# Altium schematic sheet 0153_HPB BATTERY CHARGE.SchDoc
size 848 x 558 mm
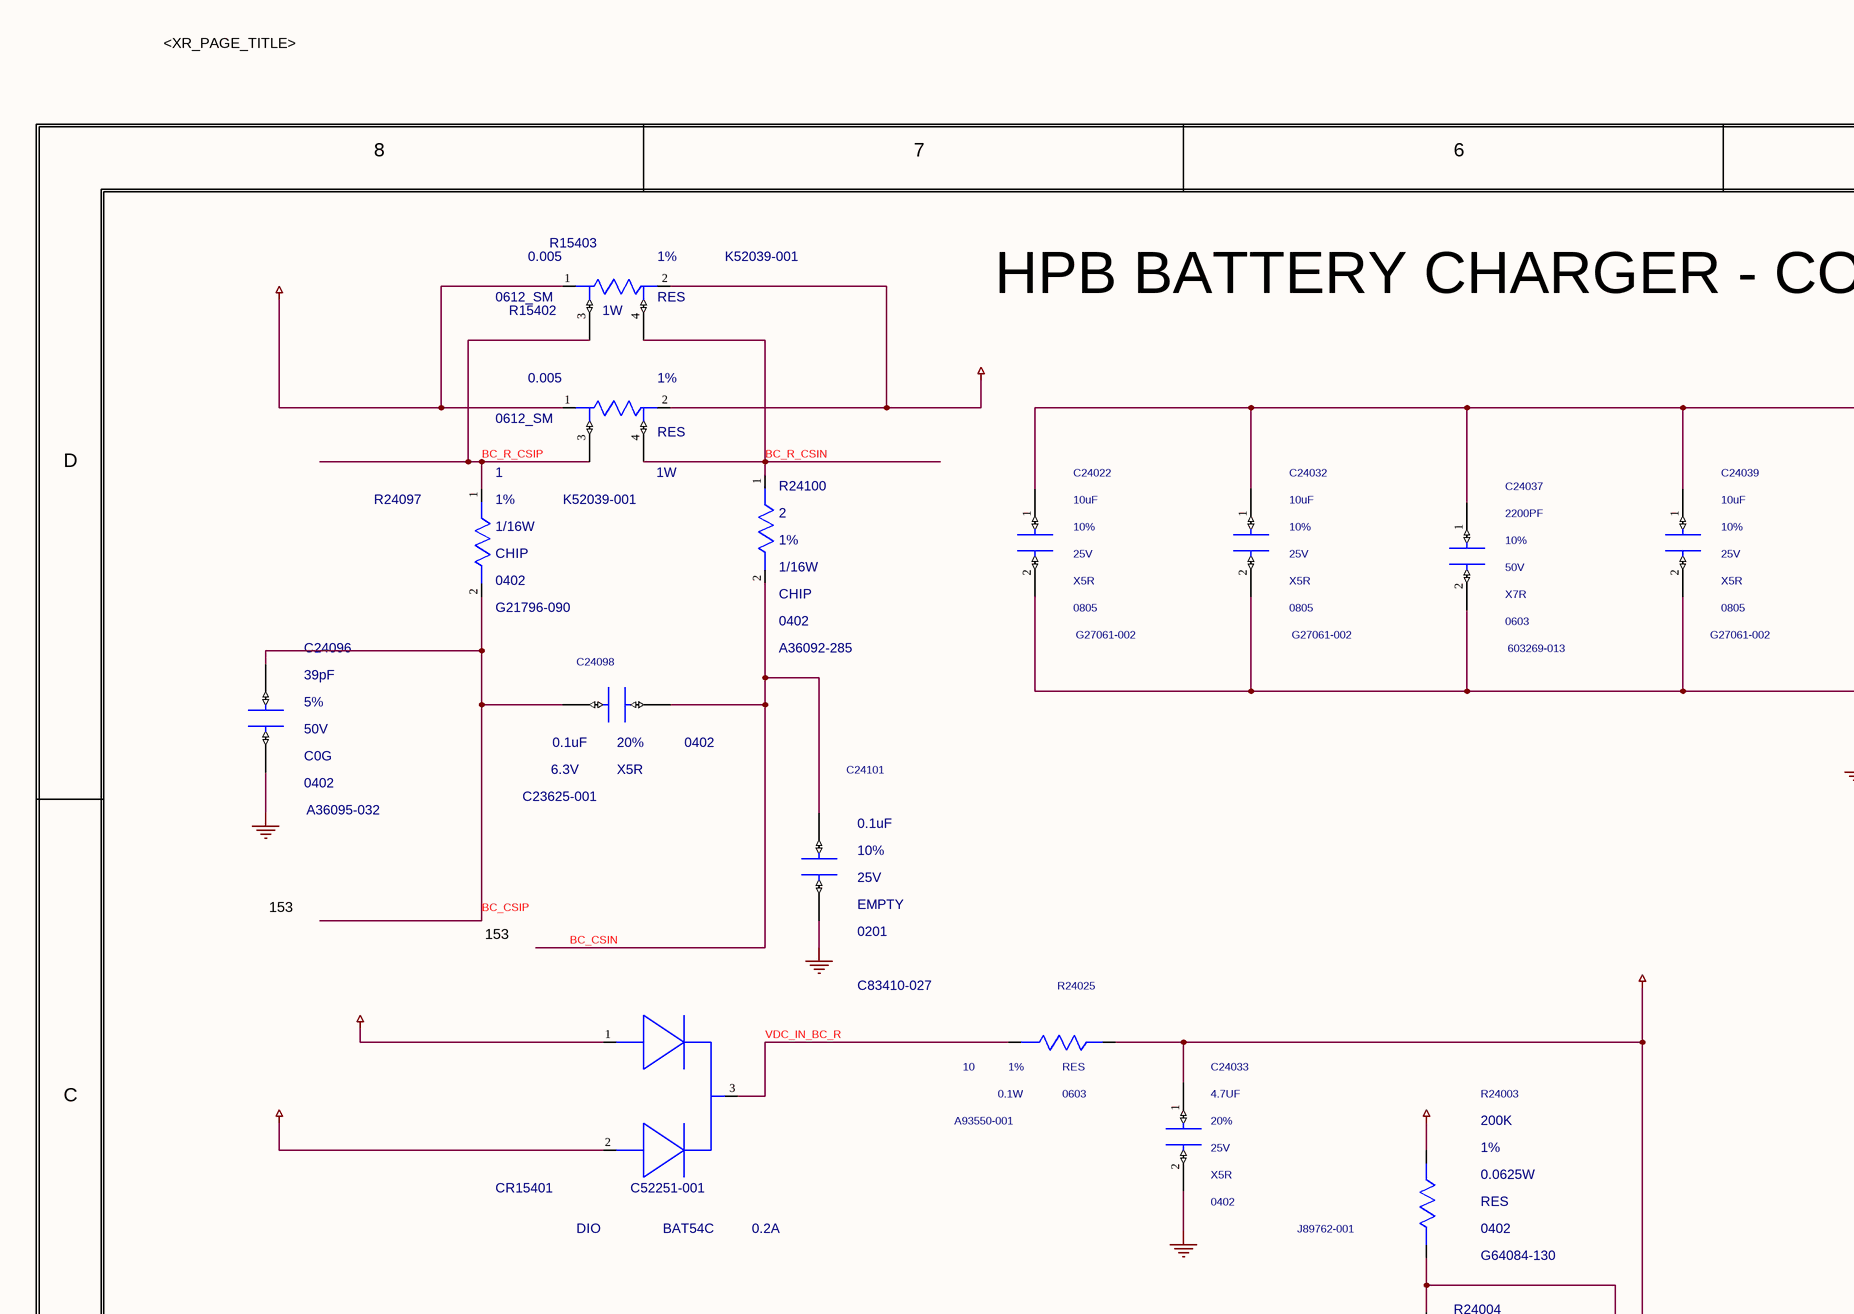
[diagram p0: 0153_HPB BATTERY CHARGE.SchDoc, top left]
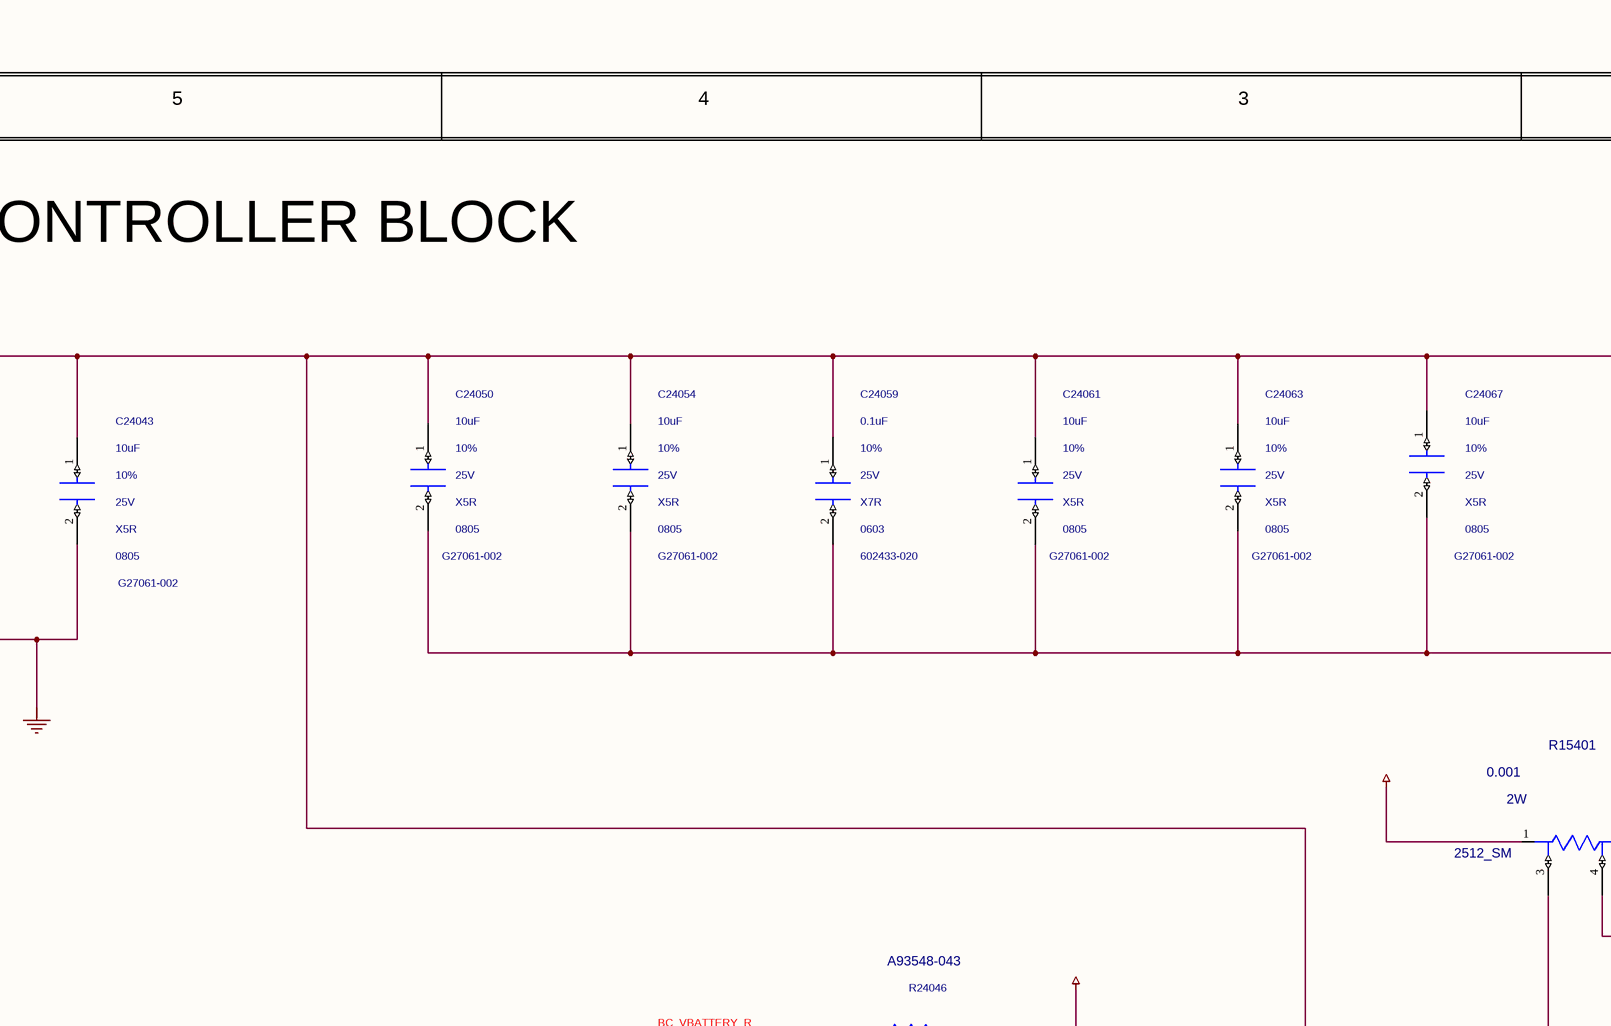
[diagram p1: 0153_HPB BATTERY CHARGE.SchDoc, top middle]
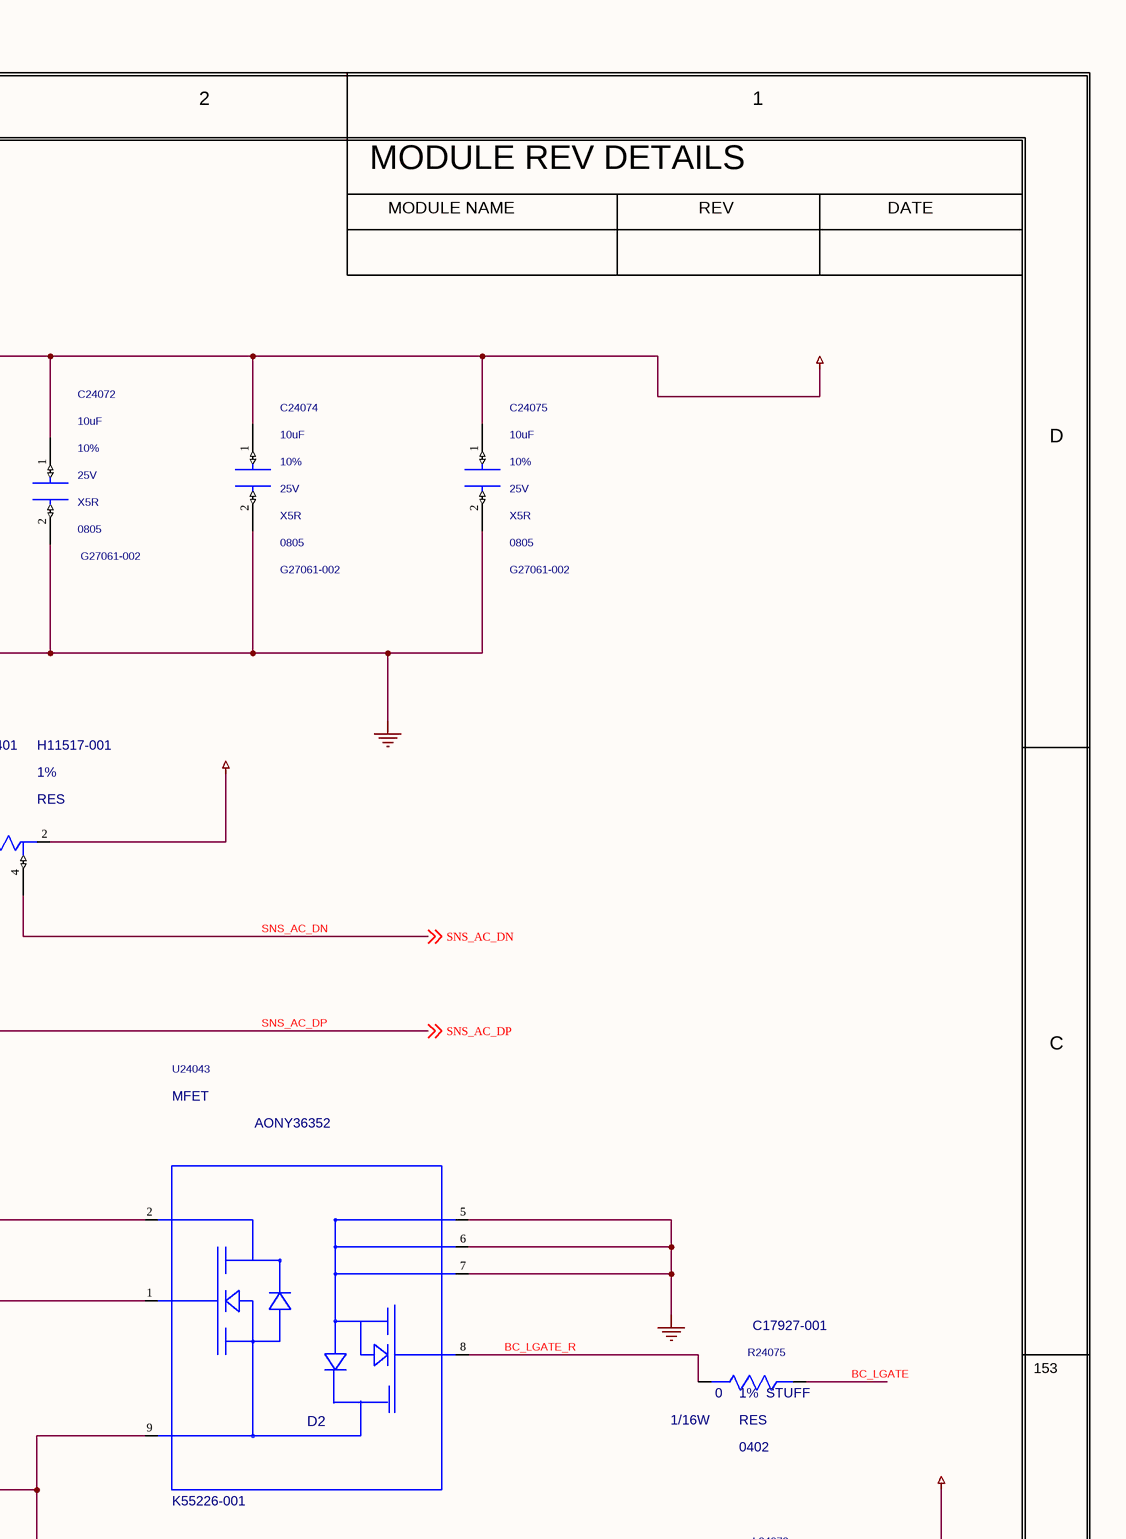
[diagram p2: 0153_HPB BATTERY CHARGE.SchDoc, top right]
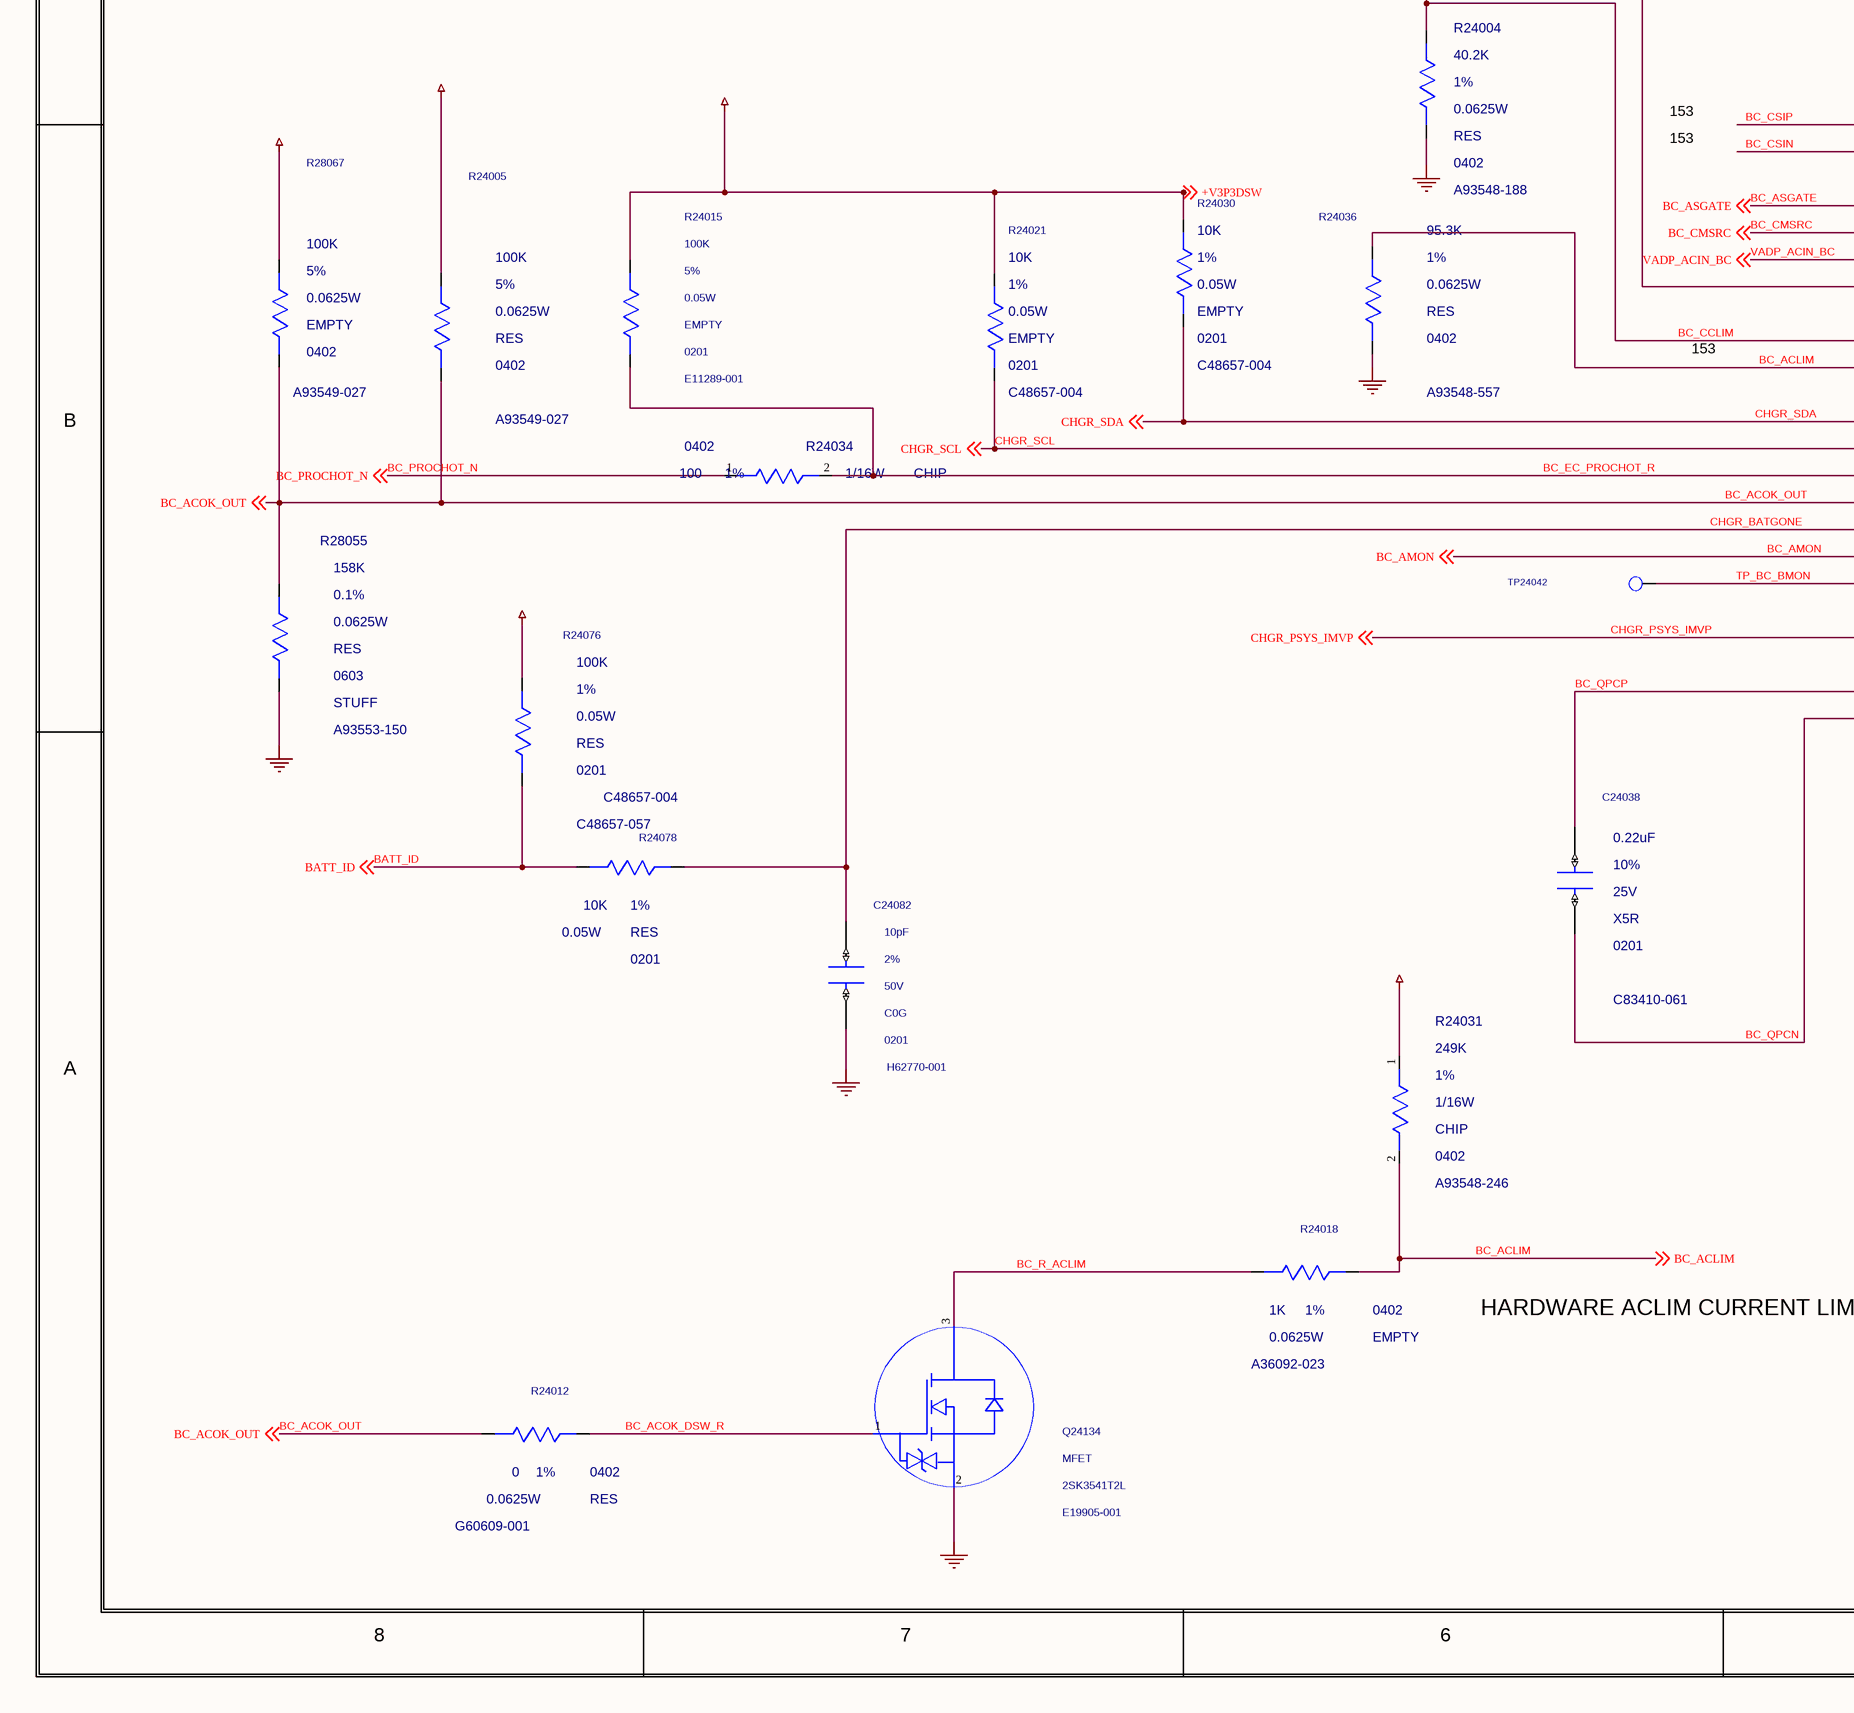
[diagram p3: 0153_HPB BATTERY CHARGE.SchDoc, bottom left]
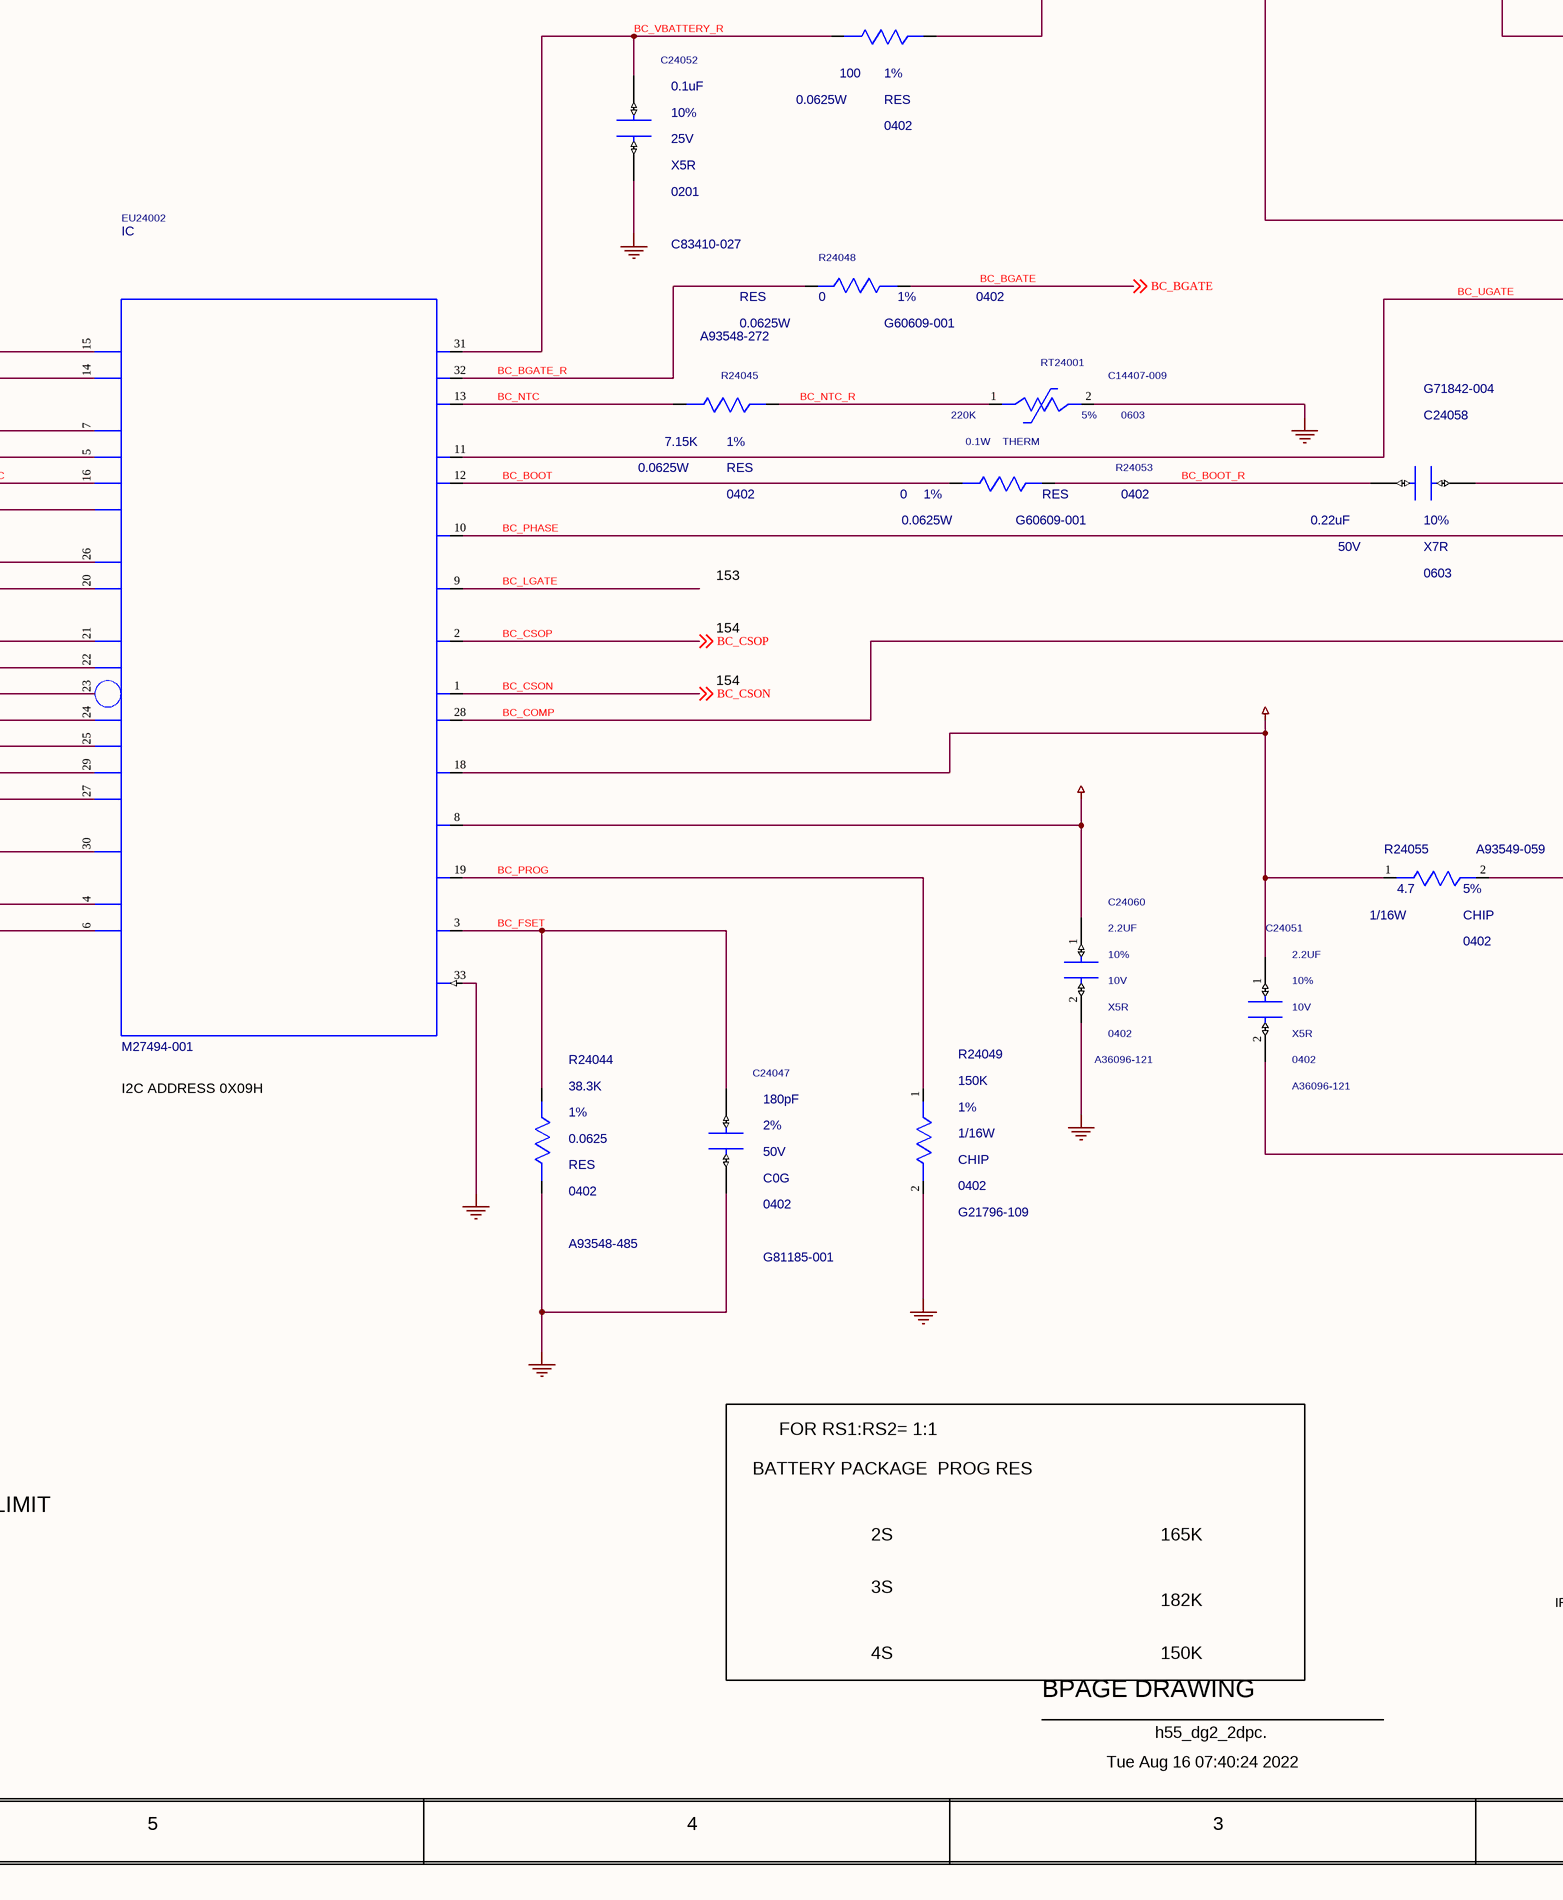
[diagram p4: 0153_HPB BATTERY CHARGE.SchDoc, bottom middle]
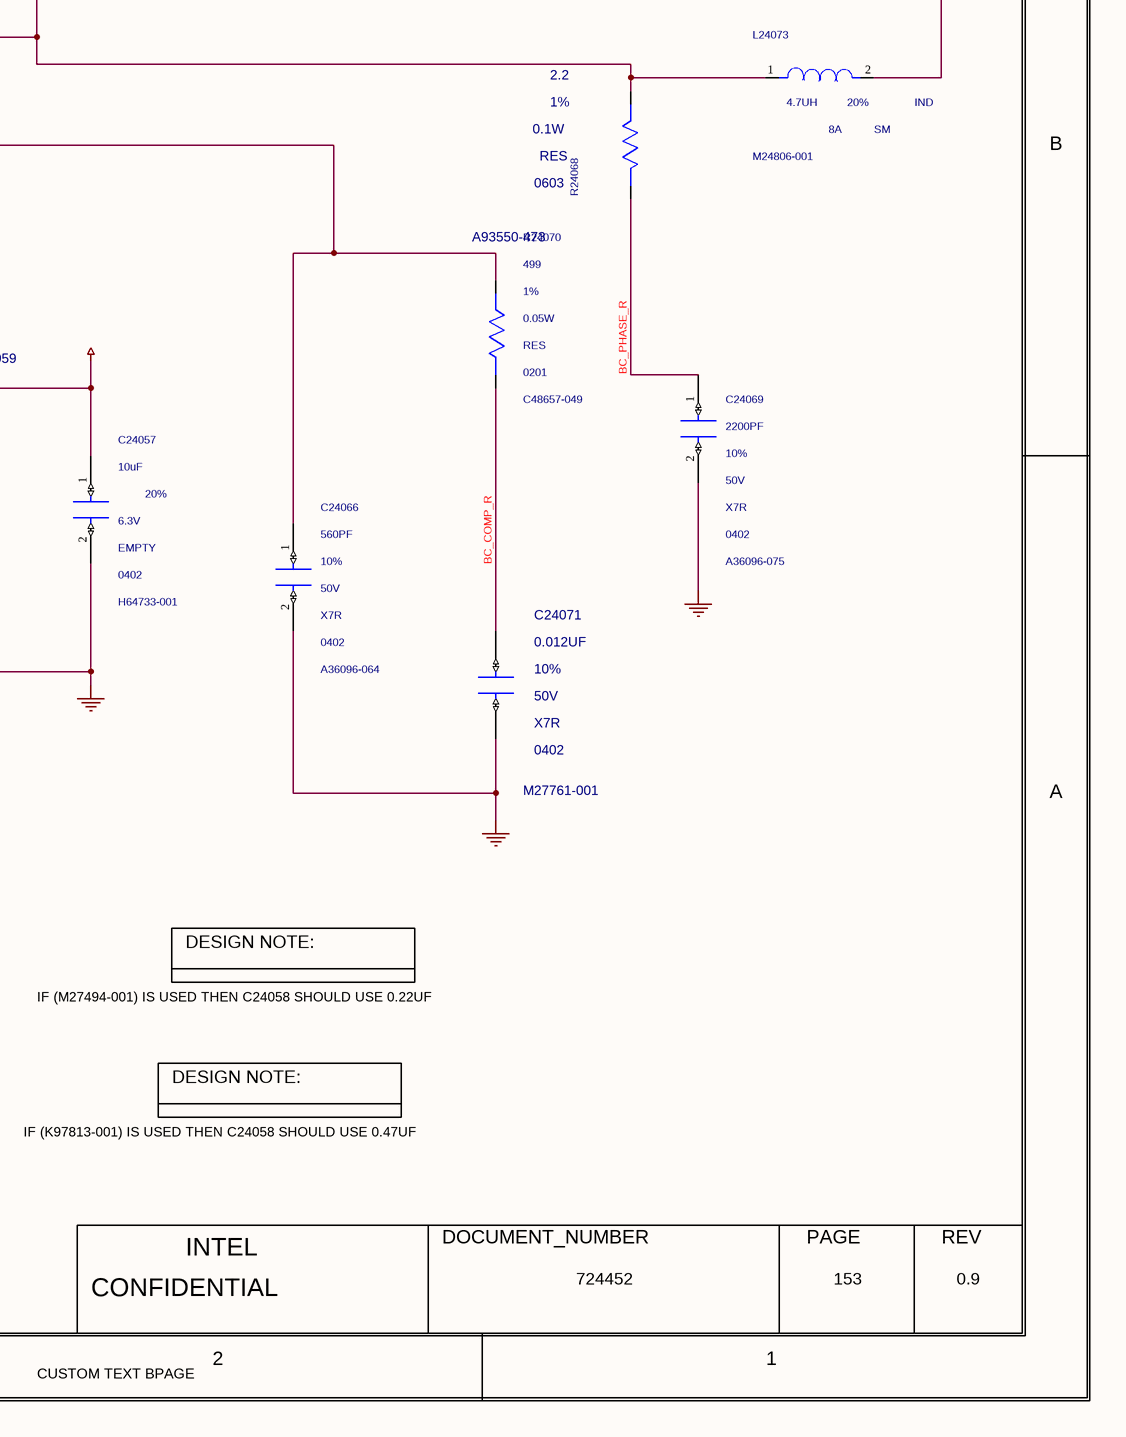
[diagram p5: 0153_HPB BATTERY CHARGE.SchDoc, bottom right]

## Parts
C24022  10uF  MATERIAL: X5R  PACK_TYPE: 0805  PART_NUMBER: G27061-002  TOLERANCE: 10%  VOLTAGE: 25V  [SMC0805MA]
C24032  10uF  MATERIAL: X5R  PACK_TYPE: 0805  PART_NUMBER: G27061-002  TOLERANCE: 10%  VOLTAGE: 25V  [SMC0805MA]
C24033  4.7UF  MATERIAL: X5R  PACK_TYPE: 0402  PART_NUMBER: J89762-001  TOLERANCE: 20%  VOLTAGE: 25V  [SMC0402MC]
C24037  2200PF  MATERIAL: X7R  PACK_TYPE: 0603  PART_NUMBER: 603269-013  TOLERANCE: 10%  VOLTAGE: 50V  [SMC0603IB]
C24038  0.22uF  MATERIAL: X5R  PACK_TYPE: 0201  PART_NUMBER: C83410-061  TOLERANCE: 10%  VOLTAGE: 25V  [CTK2_SM0201_690X390_MA]
C24039  10uF  MATERIAL: X5R  PACK_TYPE: 0805  PART_NUMBER: G27061-002  TOLERANCE: 10%  VOLTAGE: 25V  [SMC0805MA]
C24043  10uF  MATERIAL: X5R  PACK_TYPE: 0805  PART_NUMBER: G27061-002  TOLERANCE: 10%  VOLTAGE: 25V  [SMC0805MA]
C24047  180pF  MATERIAL: C0G  PACK_TYPE: 0402  PART_NUMBER: G81185-001  TOLERANCE: 2%  VOLTAGE: 50V  [CTK2_SM0402_1050X550_MA]
C24050  10uF  MATERIAL: X5R  PACK_TYPE: 0805  PART_NUMBER: G27061-002  TOLERANCE: 10%  VOLTAGE: 25V  [SMC0805MA]
C24051  2.2UF  MATERIAL: X5R  PACK_TYPE: 0402  PART_NUMBER: A36096-121  TOLERANCE: 10%  VOLTAGE: 10V  [SMC0402IA]
C24052  0.1uF  MATERIAL: X5R  PACK_TYPE: 0201  PART_NUMBER: C83410-027  TOLERANCE: 10%  VOLTAGE: 25V  [CTK2_SM0201_650X350_MA]
C24054  10uF  MATERIAL: X5R  PACK_TYPE: 0805  PART_NUMBER: G27061-002  TOLERANCE: 10%  VOLTAGE: 25V  [SMC0805MA]
C24057  10uF  MATERIAL: EMPTY  PACK_TYPE: 0402  PART_NUMBER: H64733-001  TOLERANCE: 20%  VOLTAGE: 6.3V  [SMC1005MB]
C24058  0.22uF  MATERIAL: X7R  PACK_TYPE: 0603  PART_NUMBER: G71842-004  TOLERANCE: 10%  VOLTAGE: 50V  [CTK0_SM0603_1700X900_MA]
C24059  0.1uF  MATERIAL: X7R  PACK_TYPE: 0603  PART_NUMBER: 602433-020  TOLERANCE: 10%  VOLTAGE: 25V  [SMC0603IA]
C24060  2.2UF  MATERIAL: X5R  PACK_TYPE: 0402  PART_NUMBER: A36096-121  TOLERANCE: 10%  VOLTAGE: 10V  [SMC0402IA]
C24061  10uF  MATERIAL: X5R  PACK_TYPE: 0805  PART_NUMBER: G27061-002  TOLERANCE: 10%  VOLTAGE: 25V  [SMC0805MA]
C24063  10uF  MATERIAL: X5R  PACK_TYPE: 0805  PART_NUMBER: G27061-002  TOLERANCE: 10%  VOLTAGE: 25V  [SMC0805MA]
C24066  560PF  MATERIAL: X7R  PACK_TYPE: 0402  PART_NUMBER: A36096-064  TOLERANCE: 10%  VOLTAGE: 50V  [SMC0402IA]
C24067  10uF  MATERIAL: X5R  PACK_TYPE: 0805  PART_NUMBER: G27061-002  TOLERANCE: 10%  VOLTAGE: 25V  [SMC0805MA]
C24069  2200PF  MATERIAL: X7R  PACK_TYPE: 0402  PART_NUMBER: A36096-075  TOLERANCE: 10%  VOLTAGE: 50V  [SMC0402IA]
C24071  0.012UF  MATERIAL: X7R  PACK_TYPE: 0402  PART_NUMBER: M27761-001  TOLERANCE: 10%  VOLTAGE: 50V  [CTK2_SM0402_1050X550_MA]
C24072  10uF  MATERIAL: X5R  PACK_TYPE: 0805  PART_NUMBER: G27061-002  TOLERANCE: 10%  VOLTAGE: 25V  [SMC0805MA]
C24074  10uF  MATERIAL: X5R  PACK_TYPE: 0805  PART_NUMBER: G27061-002  TOLERANCE: 10%  VOLTAGE: 25V  [SMC0805MA]
C24075  10uF  MATERIAL: X5R  PACK_TYPE: 0805  PART_NUMBER: G27061-002  TOLERANCE: 10%  VOLTAGE: 25V  [SMC0805MA]
C24082  10pF  MATERIAL: C0G  PACK_TYPE: 0201  PART_NUMBER: H62770-001  TOLERANCE: 2%  VOLTAGE: 50V  [CTK0_SM0201_630X330_MA]
C24096  39pF  MATERIAL: C0G  PACK_TYPE: 0402  PART_NUMBER: A36095-032  TOLERANCE: 5%  VOLTAGE: 50V  [CTK0_SM0402_1100X600_MA]
C24098  0.1uF  MATERIAL: X5R  PACK_TYPE: 0402  PART_NUMBER: C23625-001  TOLERANCE: 20%  VOLTAGE: 6.3V  [CTK0_SM0402_1150X650_MA]
C24101  0.1uF  MATERIAL: EMPTY  PACK_TYPE: 0201  PART_NUMBER: C83410-027  TOLERANCE: 10%  VOLTAGE: 25V  [CTK2_SM0201_650X350_MA]
CR15401  BAT54C  CURRENT: 0.2A  MATERIAL: DIO  PART_NUMBER: C52251-001  [CTK0_SOT23_1400X3040_950_MA]
EU24002  MATERIAL: IC  PART_NUMBER: M27494-001  [CTK1_LCC32_S4050_400_DFS2650_MA]  (hidden comment: C_ISL95522)
L24073  4.7UH  CURRENT: 8A  MATERIAL: IND  PACK_TYPE: SM  PART_NUMBER: M24806-001  TOLERANCE: 20%  [CTK0_SM_7300X6800_MA]
Q24134  2SK3541T2L  MATERIAL: MFET  PART_NUMBER: E19905-001  [CTK0_SOT723_900X1300_400_MA]
R15401  0.001  MATERIAL: RES  PACK_TYPE: 2512_SM  PART_NUMBER: H11517-001  TOLERANCE: 1%  WATTAGE: 2W  [CTK2_SMR4_2512_6604X3434_MA]
R15402  0.005  MATERIAL: RES  PACK_TYPE: 0612_SM  PART_NUMBER: K52039-001  TOLERANCE: 1%  WATTAGE: 1W  [CTK0_SMR4_0612_1800X3450_MB_VR]
R15403  0.005  MATERIAL: RES  PACK_TYPE: 0612_SM  PART_NUMBER: K52039-001  TOLERANCE: 1%  WATTAGE: 1W  [CTK0_SMR4_0612_1800X3450_MB_VR]
R24003  200K  MATERIAL: RES  PACK_TYPE: 0402  PART_NUMBER: G64084-130  TOLERANCE: 1%  WATTAGE: 0.0625W  [CTK0_SM0402_1100X550_MA]
R24004  40.2K  MATERIAL: RES  PACK_TYPE: 0402  PART_NUMBER: A93548-188  TOLERANCE: 1%  WATTAGE: 0.0625W  [CTK2_SM0402_1100X550_MA]
R24005  100K  MATERIAL: RES  PACK_TYPE: 0402  PART_NUMBER: A93549-027  TOLERANCE: 5%  WATTAGE: 0.0625W  [CTK0_SM0402_1100X550_MA]
R24012  0  MATERIAL: RES  PACK_TYPE: 0402  PART_NUMBER: G60609-001  TOLERANCE: 1%  WATTAGE: 0.0625W  [CTK0_SM0402_1050X550_MA]
R24015  100K  MATERIAL: EMPTY  PACK_TYPE: 0201  PART_NUMBER: E11289-001  TOLERANCE: 5%  WATTAGE: 0.05W  [CTK0_SM0201_650X350_MA]
R24018  1K  MATERIAL: EMPTY  PACK_TYPE: 0402  PART_NUMBER: A36092-023  TOLERANCE: 1%  WATTAGE: 0.0625W  [CTK0_SM0402_1050X550_MA]
R24021  10K  MATERIAL: EMPTY  PACK_TYPE: 0201  PART_NUMBER: C48657-004  TOLERANCE: 1%  WATTAGE: 0.05W  [CTK0_SM0201_630X330_MA]
R24025  10  MATERIAL: RES  PACK_TYPE: 0603  PART_NUMBER: A93550-001  TOLERANCE: 1%  WATTAGE: 0.1W  [CTK0_SM0603_1800X950_MA]
R24030  10K  MATERIAL: EMPTY  PACK_TYPE: 0201  PART_NUMBER: C48657-004  TOLERANCE: 1%  WATTAGE: 0.05W  [CTK0_SM0201_630X330_MA]
R24031  249K  MATERIAL: CHIP  PACK_TYPE: 0402  PART_NUMBER: A93548-246  TOLERANCE: 1%  WATTAGE: 1/16W  [SMR0402IA]
R24034  100  MATERIAL: CHIP  PACK_TYPE: 0402  TOLERANCE: 1%  WATTAGE: 1/16W  [SMR0402IA]
R24036  95.3K  MATERIAL: RES  PACK_TYPE: 0402  PART_NUMBER: A93548-557  TOLERANCE: 1%  WATTAGE: 0.0625W  [CTK0_SM0402_1100X550_MA]
R24044  38.3K  MATERIAL: RES  PACK_TYPE: 0402  PART_NUMBER: A93548-485  TOLERANCE: 1%  WATTAGE: 0.0625  [CTK0_SM0402_1100X550_MA]
R24045  7.15K  MATERIAL: RES  PACK_TYPE: 0402  PART_NUMBER: A93548-272  TOLERANCE: 1%  WATTAGE: 0.0625W  [CTK0_SM0402_1100X550_MA]
R24046  100  MATERIAL: RES  PACK_TYPE: 0402  PART_NUMBER: A93548-043  TOLERANCE: 1%  WATTAGE: 0.0625W  [CTK0_SM0402_1100X550_MA]
R24048  0  MATERIAL: RES  PACK_TYPE: 0402  PART_NUMBER: G60609-001  TOLERANCE: 1%  WATTAGE: 0.0625W  [CTK0_SM0402_1050X550_MA]
R24049  150K  MATERIAL: CHIP  PACK_TYPE: 0402  PART_NUMBER: G21796-109  TOLERANCE: 1%  WATTAGE: 1/16W  [SMR0402IA]
R24053  0  MATERIAL: RES  PACK_TYPE: 0402  PART_NUMBER: G60609-001  TOLERANCE: 1%  WATTAGE: 0.0625W  [CTK0_SM0402_1050X550_MA]
R24055  4.7  MATERIAL: CHIP  PACK_TYPE: 0402  PART_NUMBER: A93549-059  TOLERANCE: 5%  WATTAGE: 1/16W  [SMR0402IA]
R24068  2.2  MATERIAL: RES  PACK_TYPE: 0603  PART_NUMBER: A93550-473  TOLERANCE: 1%  WATTAGE: 0.1W  [CTK0_SM0603_1800X900_MA]
R24070  499  MATERIAL: RES  PACK_TYPE: 0201  PART_NUMBER: C48657-049  TOLERANCE: 1%  WATTAGE: 0.05W  [CTK0_SM0201_630X330_MA]
R24075  0  BOM_USE: STUFF  MATERIAL: RES  PACK_TYPE: 0402  PART_NUMBER: C17927-001  TOLERANCE: 1%  WATTAGE: 1/16W  [TK2_SM0402_1100X550_MA]
R24076  100K  MATERIAL: RES  PACK_TYPE: 0201  PART_NUMBER: C48657-057  TOLERANCE: 1%  WATTAGE: 0.05W  [CTK0_SM0201_630X330_MA]
R24078  10K  MATERIAL: RES  PACK_TYPE: 0201  PART_NUMBER: C48657-004  TOLERANCE: 1%  WATTAGE: 0.05W  [CTK0_SM0201_630X330_MA]
R24097  1  MATERIAL: CHIP  PACK_TYPE: 0402  PART_NUMBER: G21796-090  TOLERANCE: 1%  WATTAGE: 1/16W  [SMR0402IA]
R24100  2  MATERIAL: CHIP  PACK_TYPE: 0402  PART_NUMBER: A36092-285  TOLERANCE: 1%  WATTAGE: 1/16W  [SMR0402IA]
R28055  158K  BOM_USE: STUFF  MATERIAL: RES  PACK_TYPE: 0603  PART_NUMBER: A93553-150  TOLERANCE: 0.1%  WATTAGE: 0.0625W  [TK0_SM0603_1800X900_MF]
R28067  100K  MATERIAL: EMPTY  PACK_TYPE: 0402  PART_NUMBER: A93549-027  TOLERANCE: 5%  WATTAGE: 0.0625W  [CTK0_SM0402_1100X550_MA]
RT24001  220K  MATERIAL: THERM  PACK_TYPE: 0603  PART_NUMBER: C14407-009  TOLERANCE: 5%  WATTAGE: 0.1W  [CTK0_SM0603_1800X1000_MA]
TP24042  TP  [TP_C25]  (value not drawn)
U24043  AONY36352  MATERIAL: MFET  PART_NUMBER: K55226-001  [TK0_LCC8_5650X5300_1270_DF2550X4650_MA_VR]

## Nets
+V3P3DSW: R24015.1(A) R24021.1(A) R24030.1(A) R24076.1(A) ; off-sheet +V3P3DSW
+V_CHGR_CNTLR_VIN: R15402.1(PWRA) R15403.1(PWRA)
+V_CHGR_L: R15401.1(PWRA) R15402.2(PWRB) R15403.2(PWRB)
+V_CHGR_VDD: C24051.1(A) EU24002.18(VDD) R24003.1(A) R24005.1(A) R24031.1(A) R24055.1(A)
+V_CHRG_LDO: C24057.1(A) C24060.1(A) EU24002.8(VDDP) R24055.2(B)
+VADP_OUT: CR15401.1(A1)
+VBATA: C24022.1(A) C24032.1(A) C24037.1(A) C24039.1(A) C24043.1(A) C24050.1(A) C24054.1(A) C24059.1(A) C24061.1(A) C24063.1(A) C24067.1(A) C24072.1(A) C24074.1(A) C24075.1(A) CR15401.2(A2) R15401.2(PWRB) U24043.2(D1)
+VBATTERY: R24046.2(B)
+VBATTERY_IND: L24073.2(INB)
+VDC_IN_BC: C24033.1(A) R24025.2(B)
+VREG3P3_DSW: R28067.1(A)
DCIN: EU24002.17(DCIN)
GND: C24022.2(B) C24032.2(B) C24033.2(B) C24037.2(B) C24039.2(B) C24043.2(B) C24047.2(B) C24050.2(B) C24051.2(B) C24052.2(B) C24054.2(B) C24057.2(B) C24059.2(B) C24060.2(B) C24061.2(B) C24063.2(B) C24066.2(B) C24067.2(B) C24069.2(B) C24071.2(B) C24072.2(B) C24074.2(B) C24075.2(B) C24082.2(B) C24096.2(B) C24101.2(B) EU24002.33(GND_TPD) Q24134.2(S) R24004.2(B) R24036.2(B) R24044.2(B) R24049.2(B) R28055.2(B) RT24001.2(B) U24043.5(S2_1) U24043.6(S2_2) U24043.7(S2_3)
BATT_ID: R24076.2(B) R24078.1(A) ; off-sheet BATT_ID
BC_ACLIM: EU24002.20(ACLIM) R24018.2(B) R24031.2(B) R24036.1(A) ; off-sheet BC_ACLIM
BC_ACOK_DSW_R: Q24134.1(G) R24012.2(B)
BC_ACOK_OUT: EU24002.24(ACOK) R24005.2(B) R24012.1(A) R28055.1(A) R28067.2(B) ; off-sheet BC_ACOK_OUT
BC_AMON: EU24002.29(AMON) ; off-sheet BC_AMON
BC_ASGATE: EU24002.7(ASGATE) ; off-sheet BC_ASGATE
BC_BGATE: R24048.2(B) ; off-sheet BC_BGATE
BC_BGATE_R: EU24002.32(BGATE) R24048.1(A)
BC_BOOT: EU24002.12(BOOT) R24053.1(A)
BC_BOOT_R: C24058.1(A) R24053.2(B)
BC_CCLIM: EU24002.26(CCLIM) R24003.2(B) R24004.1(A)
BC_CMSRC: EU24002.5(CMSRC) ; off-sheet BC_CMSRC
BC_COMP: C24066.1(A) EU24002.28(COMP) R24070.1(A)
BC_COMP_R: C24071.1(A) R24070.2(B)
BC_CSIN: C24098.2(B) C24101.1(A) EU24002.14(CSIN) R24100.2(B)
BC_CSIP: C24096.1(A) C24098.1(A) EU24002.15(CSIP) R24097.2(B)
BC_CSON: EU24002.1(CSON) ; off-sheet BC_CSON
BC_CSOP: EU24002.2(CSOP) ; off-sheet BC_CSOP
BC_EC_PROCHOT_R: EU24002.23(PROCHOT_N) R24015.2(B) R24034.2(B)
BC_FSET: C24047.1(A) EU24002.3(FSET) R24044.1(A)
BC_LGATE: EU24002.9(LGATE) R24075.2(B)
BC_LGATE_R: R24075.1(A) U24043.8(G2)
BC_NTC: EU24002.13(NTC) R24045.1(A)
BC_NTC_R: R24045.2(B) RT24001.1(A)
BC_PHASE: C24058.2(B) EU24002.10(PHASE) L24073.1(INA) R24068.1(A) U24043.9(S1_D2)
BC_PHASE_R: C24069.1(A) R24068.2(B)
BC_PROCHOT_N: R24034.1(A) ; off-sheet BC_PROCHOT_N
BC_PROG: EU24002.19(PROG) R24049.1(A)
BC_QPCN: C24038.2(B) EU24002.6(QPCN)
BC_QPCP: C24038.1(A) EU24002.4(QPCP)
BC_R_ACLIM: Q24134.3(D) R24018.1(A)
BC_R_CSIN: R15402.4(SENB) R15403.4(SENB) R24100.1(A)
BC_R_CSIP: R15402.3(SENA) R15403.3(SENA) R24097.1(A)
BC_UGATE: EU24002.11(UGATE) U24043.1(G1)
BC_VBATTERY_R: C24052.1(A) EU24002.31(VBAT) R24046.1(A)
CHGR_BATGONE: C24082.1(A) EU24002.25(BATGONE) R24078.2(B)
CHGR_PSYS_IMVP: EU24002.30(PSYS) ; off-sheet CHGR_PSYS_IMVP
CHGR_SCL: EU24002.22(SCL) R24021.2(B) ; off-sheet CHGR_SCL
CHGR_SDA: EU24002.21(SDA) R24030.2(B) ; off-sheet CHGR_SDA
SNS_AC_DN: R15401.4(SENB) ; off-sheet SNS_AC_DN
SNS_AC_DP: R15401.3(SENA) ; off-sheet SNS_AC_DP
TP_BC_BMON: EU24002.27(BMON) TP24042.1(TP)
VADP_ACIN_BC: EU24002.16(ACIN) ; off-sheet VADP_ACIN_BC
VDC_IN_BC_R: CR15401.3(C) R24025.1(A)

## Notes on the sheet
- <XR_PAGE_TITLE>
- 8
- 7
- 6
- 5
- 4
- 3
- 2
- 1
- MODULE REV DETAILS
- HPB BATTERY CHARGER - CONTROLLER BLOCK
- MODULE NAME
- REV
- DATE
- D
- 153
- C
- B
- 154
- I2C ADDRESS 0X09H
- A
- FOR RS1:RS2= 1:1
- DESIGN NOTE:
- HARDWARE ACLIM CURRENT LIMIT
- BATTERY PACKAGE  PROG RES
- IF (M27494-001) IS USED THEN C24058 SHOULD USE 0.22UF
- 2S
- 3S
- 165K
- 4S
- 150K
- 182K
- IF (K97813-001) IS USED THEN C24058 SHOULD USE 0.47UF
- BPAGE DRAWING
- INTEL
- DOCUMENT_NUMBER
- PAGE
- Tue Aug 16 07:40:24 2022
- h55_dg2_2dpc.
- CONFIDENTIAL
- 724452
- 0.9
- CUSTOM TEXT BPAGE
- (in symbol MOSFET_N_DUAL_ASYM_2) D2

## Library data of the parts
C24022 = CAP: CDS_PHYS_PART_NAME: CAP_0805-G27061-002,X5R,10UF,25V,10%,LPDB,GENERIC; OriginalSymbolOrigin: (-50,25); XY: (2650,2975); VER: 1; ROT: 0; PHYS_PAGE: 153; LOCATION: C24022; DRAWING: @RVP1_ADL_SB_ADP_S_DDR5_SODIMM_2DPC_LIB.H55_DG2_2DPC(SCH_1):PAGE522; CDS_LIB: discrete; PCB Footprint: SMC0805MA; SEC_TYPE: 0805; CHIPS_PART_NAME: CAP; CDS_PART_NAME: CAP_0805-G27061-002,X5R,10UF,25V,10%,LPDB,GENERIC; CDS_LOCATION: C24022
C24032 = CAP: CDS_PHYS_PART_NAME: CAP_0805-G27061-002,X5R,10UF,25V,10%,LPDB,GENERIC; OriginalSymbolOrigin: (-50,25); XY: (3050,2975); VER: 1; ROT: 0; PHYS_PAGE: 153; LOCATION: C24032; DRAWING: @RVP1_ADL_SB_ADP_S_DDR5_SODIMM_2DPC_LIB.H55_DG2_2DPC(SCH_1):PAGE522; CDS_LIB: discrete; PCB Footprint: SMC0805MA; SEC_TYPE: 0805; CHIPS_PART_NAME: CAP; CDS_PART_NAME: CAP_0805-G27061-002,X5R,10UF,25V,10%,LPDB,GENERIC; CDS_LOCATION: C24032
C24033 = CAP: CDS_PHYS_PART_NAME: CAP_0402-J89762-001,X5R,4.7UF,25V,20%,LPDB,GENERIC; OriginalSymbolOrigin: (-50,25); XY: (2925,1875); VER: 1; SUB_ROOM_2: DECOUPLING; SUB_ROOM_1: V_CHRG_LDO; ROT: 2; PHYS_PAGE: 153; LOCATION: C24033; DRAWING: @RVP1_ADL_SB_ADP_S_DDR5_SODIMM_2DPC_LIB.H55_DG2_2DPC(SCH_1):PAGE522; CDS_LIB: discrete; PCB Footprint: SMC0402MC; SUB_ROOM: DECOUPLING; SEC_TYPE: 0402; CHIPS_PART_NAME: CAP; CDS_PART_NAME: CAP_0402-J89762-001,X5R,4.7UF,25V,20%,LPDB,GENERIC; CDS_LOCATION: C24033
C24037 = CAP: CDS_PHYS_PART_NAME: CAP_0603-603269-013,X7R,2200PF,50V,10%,LPDB,GENERIC; OriginalSymbolOrigin: (-50,25); XY: (3450,2950); VER: 1; ROT: 0; PHYS_PAGE: 153; LOCATION: C24037; DRAWING: @RVP1_ADL_SB_ADP_S_DDR5_SODIMM_2DPC_LIB.H55_DG2_2DPC(SCH_1):PAGE522; CDS_LIB: discrete; PCB Footprint: SMC0603IB; SEC_TYPE: 0603; CHIPS_PART_NAME: CAP; CDS_PART_NAME: CAP_0603-603269-013,X7R,2200PF,50V,10%,LPDB,GENERIC; CDS_LOCATION: C24037
C24038 = C_CAP: CDS_PHYS_PART_NAME: C_CAP_0201-C83410-061,X5R,0.22UF,25V,10%,TK2,GENERIC; CDS_LMAN_SYM_OUTLINE: -50,50,50,-50; FP_TECH: TK2; IP: GENERIC; ROOM: NONE; OriginalSymbolOrigin: (-50,25); XY: (3650,-25); VER: 1; ROT: 0; PHYS_PAGE: 153; LOCATION: C24038; DRAWING: @RVP1_ADL_SB_ADP_S_DDR5_SODIMM_2DPC_LIB.H55_DG2_2DPC(SCH_1):PAGE522; CDS_LIB: c_discrete; VARIANT: ?; PCB Footprint: CTK2_SM0201_690X390_MA; CHIPS_PART_NAME: C_CAP; CDS_PART_NAME: C_CAP_0201-C83410-061,X5R,0.22UF,25V,10%,TK2,GENERIC; CDS_LOCATION: C24038
C24039 = CAP: CDS_PHYS_PART_NAME: CAP_0805-G27061-002,X5R,10UF,25V,10%,LPDB,GENERIC; OriginalSymbolOrigin: (-50,25); XY: (3850,2975); VER: 1; ROT: 0; PHYS_PAGE: 153; LOCATION: C24039; DRAWING: @RVP1_ADL_SB_ADP_S_DDR5_SODIMM_2DPC_LIB.H55_DG2_2DPC(SCH_1):PAGE522; CDS_LIB: discrete; PCB Footprint: SMC0805MA; SEC_TYPE: 0805; CHIPS_PART_NAME: CAP; CDS_PART_NAME: CAP_0805-G27061-002,X5R,10UF,25V,10%,LPDB,GENERIC; CDS_LOCATION: C24039
C24043 = CAP: CDS_PHYS_PART_NAME: CAP_0805-G27061-002,X5R,10UF,25V,10%,LPDB,GENERIC; OriginalSymbolOrigin: (-50,25); XY: (4250,2975); VER: 1; ROT: 0; PHYS_PAGE: 153; LOCATION: C24043; DRAWING: @RVP1_ADL_SB_ADP_S_DDR5_SODIMM_2DPC_LIB.H55_DG2_2DPC(SCH_1):PAGE522; CDS_LIB: discrete; PCB Footprint: SMC0805MA; SEC_TYPE: 0805; CHIPS_PART_NAME: CAP; CDS_PART_NAME: CAP_0805-G27061-002,X5R,10UF,25V,10%,LPDB,GENERIC; CDS_LOCATION: C24043
C24047 = C_CAP: CDS_PHYS_PART_NAME: C_CAP_0402-G81185-001,C0G,180PF,50V,2%,TK2,GENERIC; CDS_LMAN_SYM_OUTLINE: -50,50,50,-50; FP_TECH: TK2; IP: GENERIC; ROOM: NONE; OriginalSymbolOrigin: (-50,25); XY: (5500,-125); VER: 1; ROT: 0; PHYS_PAGE: 153; LOCATION: C24047; DRAWING: @RVP1_ADL_SB_ADP_S_DDR5_SODIMM_2DPC_LIB.H55_DG2_2DPC(SCH_1):PAGE522; CDS_LIB: c_discrete; VARIANT: ?; PCB Footprint: CTK2_SM0402_1050X550_MA; CHIPS_PART_NAME: C_CAP; CDS_PART_NAME: C_CAP_0402-G81185-001,C0G,180PF,50V,2%,TK2,GENERIC; CDS_LOCATION: C24047
C24050 = CAP: CDS_PHYS_PART_NAME: CAP_0805-G27061-002,X5R,10UF,25V,10%,LPDB,GENERIC; OriginalSymbolOrigin: (-50,25); XY: (4900,3000); VER: 1; ROT: 0; PHYS_PAGE: 153; LOCATION: C24050; DRAWING: @RVP1_ADL_SB_ADP_S_DDR5_SODIMM_2DPC_LIB.H55_DG2_2DPC(SCH_1):PAGE522; CDS_LIB: discrete; PCB Footprint: SMC0805MA; SEC_TYPE: 0805; CHIPS_PART_NAME: CAP; CDS_PART_NAME: CAP_0805-G27061-002,X5R,10UF,25V,10%,LPDB,GENERIC; CDS_LOCATION: C24050
C24051 = CAP: CDS_PHYS_PART_NAME: CAP_0402-A36096-121,X5R,2.2UF,10V,10%,LPDB,GENERIC; OriginalSymbolOrigin: (-50,25); XY: (6525,125); VER: 1; SUB_ROOM_2: DECOUPLING; SUB_ROOM_1: V_CHRG_LDO; ROT: 2; PHYS_PAGE: 153; LOCATION: C24051; DRAWING: @RVP1_ADL_SB_ADP_S_DDR5_SODIMM_2DPC_LIB.H55_DG2_2DPC(SCH_1):PAGE522; CDS_LIB: discrete; PCB Footprint: SMC0402IA; SUB_ROOM: DECOUPLING; SEC_TYPE: 0402; CHIPS_PART_NAME: CAP; CDS_PART_NAME: CAP_0402-A36096-121,X5R,2.2UF,10V,10%,LPDB,GENERIC; CDS_LOCATION: C24051
C24052 = C_CAP: CDS_PHYS_PART_NAME: C_CAP_0201-C83410-027,X5R,0.1UF,25V,10%,TK2,GENERIC; CDS_LMAN_SYM_OUTLINE: -50,50,50,-50; FP_TECH: TK2; IP: GENERIC; ROOM: NONE; OriginalSymbolOrigin: (-50,25); XY: (5325,1800); VER: 1; ROT: 0; PHYS_PAGE: 153; LOCATION: C24052; DRAWING: @RVP1_ADL_SB_ADP_S_DDR5_SODIMM_2DPC_LIB.H55_DG2_2DPC(SCH_1):PAGE522; CDS_LIB: c_discrete; VARIANT: ?; PCB Footprint: CTK2_SM0201_650X350_MA; CHIPS_PART_NAME: C_CAP; CDS_PART_NAME: C_CAP_0201-C83410-027,X5R,0.1UF,25V,10%,TK2,GENERIC; CDS_LOCATION: C24052
C24054 = CAP: CDS_PHYS_PART_NAME: CAP_0805-G27061-002,X5R,10UF,25V,10%,LPDB,GENERIC; OriginalSymbolOrigin: (-50,25); XY: (5275,3000); VER: 1; ROT: 0; PHYS_PAGE: 153; LOCATION: C24054; DRAWING: @RVP1_ADL_SB_ADP_S_DDR5_SODIMM_2DPC_LIB.H55_DG2_2DPC(SCH_1):PAGE522; CDS_LIB: discrete; PCB Footprint: SMC0805MA; SEC_TYPE: 0805; CHIPS_PART_NAME: CAP; CDS_PART_NAME: CAP_0805-G27061-002,X5R,10UF,25V,10%,LPDB,GENERIC; CDS_LOCATION: C24054
C24057 = CAP: CDS_PHYS_PART_NAME: CAP_0402-H64733-001,EMPTY,10UF,6.3V,20%,LPDB,GENERIC; OriginalSymbolOrigin: (-50,25); XY: (7200,150); VER: 1; ROT: 0; PHYS_PAGE: 153; LOCATION: C24057; DRAWING: @RVP1_ADL_SB_ADP_S_DDR5_SODIMM_2DPC_LIB.H55_DG2_2DPC(SCH_1):PAGE522; CDS_LIB: discrete; PCB Footprint: SMC1005MB; SEC_TYPE: 0402; CHIPS_PART_NAME: CAP; CDS_PART_NAME: CAP_0402-H64733-001,EMPTY,10UF,6.3V,20%,LPDB,GENERIC; CDS_LOCATION: C24057
C24058 = C_CAP#1: CHIPS_PART_NAME: C_CAP; CDS_PHYS_PART_NAME: C_CAP_0603-G71842-004,X7R,0.22UF,50V,10%,TK0,GENERIC; CDS_LMAN_SYM_OUTLINE: -50,50,50,-50; FP_TECH: TK0; IP: GENERIC; ROOM: NONE; OriginalSymbolOrigin: (-25,50); XY: (6825,1125); VER: 2; ROT: 0; PHYS_PAGE: 153; LOCATION: C24058; DRAWING: @RVP1_ADL_SB_ADP_S_DDR5_SODIMM_2DPC_LIB.H55_DG2_2DPC(SCH_1):PAGE522; CDS_LIB: c_discrete; VARIANT: ?; PCB Footprint: CTK0_SM0603_1700X900_MA; CDS_PART_NAME: C_CAP_0603-G71842-004,X7R,0.22UF,50V,10%,TK0,GENERIC; CDS_LOCATION: C24058
C24059 = CAP: CDS_PHYS_PART_NAME: CAP_0603-602433-020,X7R,0.1UF,25V,10%,LPDB,GENERIC; OriginalSymbolOrigin: (-50,25); XY: (5650,2975); VER: 1; ROT: 0; PHYS_PAGE: 153; LOCATION: C24059; DRAWING: @RVP1_ADL_SB_ADP_S_DDR5_SODIMM_2DPC_LIB.H55_DG2_2DPC(SCH_1):PAGE522; CDS_LIB: discrete; PCB Footprint: SMC0603IA; SEC_TYPE: 0603; CHIPS_PART_NAME: CAP; CDS_PART_NAME: CAP_0603-602433-020,X7R,0.1UF,25V,10%,LPDB,GENERIC; CDS_LOCATION: C24059
C24060 = CAP: CDS_PHYS_PART_NAME: CAP_0402-A36096-121,X5R,2.2UF,10V,10%,LPDB,GENERIC; OriginalSymbolOrigin: (-50,25); XY: (6175,200); VER: 1; SUB_ROOM_2: DECOUPLING; SUB_ROOM_1: V_CHRG_LDO; ROT: 2; PHYS_PAGE: 153; LOCATION: C24060; DRAWING: @RVP1_ADL_SB_ADP_S_DDR5_SODIMM_2DPC_LIB.H55_DG2_2DPC(SCH_1):PAGE522; CDS_LIB: discrete; PCB Footprint: SMC0402IA; SUB_ROOM: DECOUPLING; SEC_TYPE: 0402; CHIPS_PART_NAME: CAP; CDS_PART_NAME: CAP_0402-A36096-121,X5R,2.2UF,10V,10%,LPDB,GENERIC; CDS_LOCATION: C24060
C24061 = CAP: CDS_PHYS_PART_NAME: CAP_0805-G27061-002,X5R,10UF,25V,10%,LPDB,GENERIC; OriginalSymbolOrigin: (-50,25); XY: (6025,2975); VER: 1; ROT: 0; PHYS_PAGE: 153; LOCATION: C24061; DRAWING: @RVP1_ADL_SB_ADP_S_DDR5_SODIMM_2DPC_LIB.H55_DG2_2DPC(SCH_1):PAGE522; CDS_LIB: discrete; PCB Footprint: SMC0805MA; SEC_TYPE: 0805; CHIPS_PART_NAME: CAP; CDS_PART_NAME: CAP_0805-G27061-002,X5R,10UF,25V,10%,LPDB,GENERIC; CDS_LOCATION: C24061
C24063 = CAP: CDS_PHYS_PART_NAME: CAP_0805-G27061-002,X5R,10UF,25V,10%,LPDB,GENERIC; OriginalSymbolOrigin: (-50,25); XY: (6400,3000); VER: 1; ROT: 0; PHYS_PAGE: 153; LOCATION: C24063; DRAWING: @RVP1_ADL_SB_ADP_S_DDR5_SODIMM_2DPC_LIB.H55_DG2_2DPC(SCH_1):PAGE522; CDS_LIB: discrete; PCB Footprint: SMC0805MA; SEC_TYPE: 0805; CHIPS_PART_NAME: CAP; CDS_PART_NAME: CAP_0805-G27061-002,X5R,10UF,25V,10%,LPDB,GENERIC; CDS_LOCATION: C24063
C24066 = CAP: CDS_PHYS_PART_NAME: CAP_0402-A36096-064,X7R,560PF,50V,10%,LPDB,GENERIC; OriginalSymbolOrigin: (-50,25); XY: (7575,25); VER: 1; ROT: 0; PHYS_PAGE: 153; LOCATION: C24066; DRAWING: @RVP1_ADL_SB_ADP_S_DDR5_SODIMM_2DPC_LIB.H55_DG2_2DPC(SCH_1):PAGE522; CDS_LIB: discrete; PCB Footprint: SMC0402IA; SEC_TYPE: 0402; CHIPS_PART_NAME: CAP; CDS_PART_NAME: CAP_0402-A36096-064,X7R,560PF,50V,10%,LPDB,GENERIC; CDS_LOCATION: C24066
C24067 = CAP: CDS_PHYS_PART_NAME: CAP_0805-G27061-002,X5R,10UF,25V,10%,LPDB,GENERIC; OriginalSymbolOrigin: (-50,25); XY: (6750,3025); VER: 1; ROT: 0; PHYS_PAGE: 153; LOCATION: C24067; DRAWING: @RVP1_ADL_SB_ADP_S_DDR5_SODIMM_2DPC_LIB.H55_DG2_2DPC(SCH_1):PAGE522; CDS_LIB: discrete; PCB Footprint: SMC0805MA; SEC_TYPE: 0805; CHIPS_PART_NAME: CAP; CDS_PART_NAME: CAP_0805-G27061-002,X5R,10UF,25V,10%,LPDB,GENERIC; CDS_LOCATION: C24067
C24069 = CAP: CDS_PHYS_PART_NAME: CAP_0402-A36096-075,X7R,2200PF,50V,10%,LPDB,GENERIC; OriginalSymbolOrigin: (-50,25); XY: (8325,300); VER: 1; ROT: 0; PHYS_PAGE: 153; LOCATION: C24069; DRAWING: @RVP1_ADL_SB_ADP_S_DDR5_SODIMM_2DPC_LIB.H55_DG2_2DPC(SCH_1):PAGE522; CDS_LIB: discrete; PCB Footprint: SMC0402IA; SEC_TYPE: 0402; CHIPS_PART_NAME: CAP; CDS_PART_NAME: CAP_0402-A36096-075,X7R,2200PF,50V,10%,LPDB,GENERIC; CDS_LOCATION: C24069
C24071 = C_CAP: CDS_PHYS_PART_NAME: C_CAP_0402-M27761-001,X7R,0.012UF,50V,10%,TK2,GENERIC; CDS_LMAN_SYM_OUTLINE: -50,50,50,-50; FP_TECH: TK2; IP: GENERIC; ROOM: NONE; OriginalSymbolOrigin: (-50,25); XY: (7950,-175); VER: 1; ROT: 0; PHYS_PAGE: 153; LOCATION: C24071; DRAWING: @RVP1_ADL_SB_ADP_S_DDR5_SODIMM_2DPC_LIB.H55_DG2_2DPC(SCH_1):PAGE522; CDS_LIB: c_discrete; VARIANT: ?; PCB Footprint: CTK2_SM0402_1050X550_MA; SEC_TYPE: 0402; CHIPS_PART_NAME: C_CAP; CDS_PART_NAME: C_CAP_0402-M27761-001,X7R,0.012UF,50V,10%,TK2,GENERIC; CDS_LOCATION: C24071
C24072 = CAP: CDS_PHYS_PART_NAME: CAP_0805-G27061-002,X5R,10UF,25V,10%,LPDB,GENERIC; OriginalSymbolOrigin: (-50,25); XY: (7125,2975); VER: 1; ROT: 0; PHYS_PAGE: 153; LOCATION: C24072; DRAWING: @RVP1_ADL_SB_ADP_S_DDR5_SODIMM_2DPC_LIB.H55_DG2_2DPC(SCH_1):PAGE522; CDS_LIB: discrete; PCB Footprint: SMC0805MA; SEC_TYPE: 0805; CHIPS_PART_NAME: CAP; CDS_PART_NAME: CAP_0805-G27061-002,X5R,10UF,25V,10%,LPDB,GENERIC; CDS_LOCATION: C24072
C24074 = CAP: CDS_PHYS_PART_NAME: CAP_0805-G27061-002,X5R,10UF,25V,10%,LPDB,GENERIC; OriginalSymbolOrigin: (-50,25); XY: (7500,3000); VER: 1; ROT: 0; PHYS_PAGE: 153; LOCATION: C24074; DRAWING: @RVP1_ADL_SB_ADP_S_DDR5_SODIMM_2DPC_LIB.H55_DG2_2DPC(SCH_1):PAGE522; CDS_LIB: discrete; PCB Footprint: SMC0805MA; SEC_TYPE: 0805; CHIPS_PART_NAME: CAP; CDS_PART_NAME: CAP_0805-G27061-002,X5R,10UF,25V,10%,LPDB,GENERIC; CDS_LOCATION: C24074
C24075 = CAP: CDS_PHYS_PART_NAME: CAP_0805-G27061-002,X5R,10UF,25V,10%,LPDB,GENERIC; OriginalSymbolOrigin: (-50,25); XY: (7925,3000); VER: 1; ROT: 0; PHYS_PAGE: 153; LOCATION: C24075; DRAWING: @RVP1_ADL_SB_ADP_S_DDR5_SODIMM_2DPC_LIB.H55_DG2_2DPC(SCH_1):PAGE522; CDS_LIB: discrete; PCB Footprint: SMC0805MA; SEC_TYPE: 0805; CHIPS_PART_NAME: CAP; CDS_PART_NAME: CAP_0805-G27061-002,X5R,10UF,25V,10%,LPDB,GENERIC; CDS_LOCATION: C24075
C24082 = C_CAP: CDS_PHYS_PART_NAME: C_CAP_0201-H62770-001,C0G,10PF,50V,2%,TK0,GENERIC; CDS_LMAN_SYM_OUTLINE: -50,50,50,-50; FP_TECH: TK0; IP: GENERIC; ROOM: NONE; OriginalSymbolOrigin: (-50,25); XY: (2300,-200); VER: 1; ROT: 0; PHYS_PAGE: 153; LOCATION: C24082; DRAWING: @RVP1_ADL_SB_ADP_S_DDR5_SODIMM_2DPC_LIB.H55_DG2_2DPC(SCH_1):PAGE522; CDS_LIB: c_discrete; VARIANT: ?; PCB Footprint: CTK0_SM0201_630X330_MA; CHIPS_PART_NAME: C_CAP; CDS_PART_NAME: C_CAP_0201-H62770-001,C0G,10PF,50V,2%,TK0,GENERIC; CDS_LOCATION: C24082
C24096 = C_CAP: CDS_PHYS_PART_NAME: C_CAP_0402-A36095-032,C0G,39PF,50V,5%,TK0,GENERIC; CDS_LMAN_SYM_OUTLINE: -50,50,50,-50; FP_TECH: TK0; IP: GENERIC; ROOM: NONE; OriginalSymbolOrigin: (-50,25); XY: (1225,2650); VER: 1; ROT: 0; PHYS_PAGE: 153; LOCATION: C24096; DRAWING: @RVP1_ADL_SB_ADP_S_DDR5_SODIMM_2DPC_LIB.H55_DG2_2DPC(SCH_1):PAGE522; CDS_LIB: c_discrete; VARIANT: ?; PCB Footprint: CTK0_SM0402_1100X600_MA; CHIPS_PART_NAME: C_CAP; CDS_PART_NAME: C_CAP_0402-A36095-032,C0G,39PF,50V,5%,TK0,GENERIC; CDS_LOCATION: C24096
C24098 = C_CAP#1: CHIPS_PART_NAME: C_CAP; CDS_PHYS_PART_NAME: C_CAP_0402-C23625-001,X5R,0.1UF,6.3V,20%,TK0,GENERIC; CDS_LMAN_SYM_OUTLINE: -50,50,50,-50; FP_TECH: TK0; IP: GENERIC; ROOM: NONE; OriginalSymbolOrigin: (-25,50); XY: (1875,2675); VER: 2; SUB_ROOM_2: PLACEHOLDER; SUB_ROOM_1: V_CHRG_LDO; SUB_ROOM: COMPENSATION; ROT: 0; PHYS_PAGE: 153; LOCATION: C24098; DRAWING: @RVP1_ADL_SB_ADP_S_DDR5_SODIMM_2DPC_LIB.H55_DG2_2DPC(SCH_1):PAGE522; CDS_LIB: c_discrete; VARIANT: ?; PCB Footprint: CTK0_SM0402_1150X650_MA; SEC_TYPE: 0402; CDS_PART_NAME: C_CAP_0402-C23625-001,X5R,0.1UF,6.3V,20%,TK0,GENERIC; CDS_LOCATION: C24098
C24101 = C_CAP: CDS_PHYS_PART_NAME: C_CAP_0201-C83410-027,EMPTY,0.1UF,25V,10%,TK2,GENERIC; CDS_LMAN_SYM_OUTLINE: -50,50,50,-50; FP_TECH: TK2; IP: GENERIC; ROOM: NONE; OriginalSymbolOrigin: (-50,25); XY: (2250,2375); VER: 1; SUB_ROOM_2: PLACEHOLDER; SUB_ROOM_1: V_CHRG_LDO; SUB_ROOM: DECOUPLING; ROT: 0; PHYS_PAGE: 153; LOCATION: C24101; DRAWING: @RVP1_ADL_SB_ADP_S_DDR5_SODIMM_2DPC_LIB.H55_DG2_2DPC(SCH_1):PAGE522; CDS_LIB: c_discrete; VARIANT: ?; PCB Footprint: CTK2_SM0201_650X350_MA; CHIPS_PART_NAME: C_CAP; CDS_PART_NAME: C_CAP_0201-C83410-027,EMPTY,0.1UF,25V,10%,TK2,GENERIC; CDS_LOCATION: C24101
CR15401 = C_BAT54C: CDS_PHYS_PART_NAME: C_BAT54C_SOT23-C52251-001,DIO,BAT54C,0.2A,TK0,GENERIC; CDS_LMAN_SYM_OUTLINE: -100,150,50,-150; FP_TECH: TK0; IP: GENERIC; PACK_TYPE: SOT23; ROOM: NONE; OriginalSymbolOrigin: (-125,150); XY: (2000,1950); VER: 1; ROT: 0; PHYS_PAGE: 153; LOCATION: CR15401; DRAWING: @RVP1_ADL_SB_ADP_S_DDR5_SODIMM_2DPC_LIB.H55_DG2_2DPC(SCH_1):PAGE522; CDS_LIB: local; VARIANT: ?; PCB Footprint: CTK0_SOT23_1400X3040_950_MA; CHIPS_PART_NAME: C_BAT54C; CDS_PART_NAME: C_BAT54C_SOT23-C52251-001,DIO,BAT54C,0.2A,TK0,GENERIC; CDS_LOCATION: CR15401
EU24002 = C_ISL95522: CDS_PHYS_PART_NAME: C_ISL95522_LCC-M27494-001,IC,ISL95522AHRZ,TK1,GENERIC; CDS_LMAN_SYM_OUTLINE: -300,700,300,-700; FP_TECH: TK1; IP: GENERIC; PACK_TYPE: LCC; ROOM: NONE; OriginalSymbolOrigin: (-350,700); XY: (4650,775); VER: 1; ROT: 0; PHYS_PAGE: 153; LOCATION: EU24002; DRAWING: @RVP1_ADL_SB_ADP_S_DDR5_SODIMM_2DPC_LIB.H55_DG2_2DPC(SCH_1):PAGE522; CDS_LIB: local; VARIANT: ?; PCB Footprint: CTK1_LCC32_S4050_400_DFS2650_MA; SEC_TYPE: LCC; CHIPS_PART_NAME: C_ISL95522; CDS_PART_NAME: C_ISL95522_LCC-M27494-001,IC,ISL95522AHRZ,TK1,GENERIC; CDS_LOCATION: EU24002
L24073 = C_INDUCTOR: CDS_PHYS_PART_NAME: C_INDUCTOR_SM-M24806-001,IND,4.7UH,20%,8A,TK0,GENERIC; CDS_LMAN_SYM_OUTLINE: -100,50,100,-50; FP_TECH: TK0; IP: GENERIC; ROOM: NONE; OriginalSymbolOrigin: (-75,25); XY: (8550,950); VER: 1; ROT: 0; PHYS_PAGE: 153; LOCATION: L24073; DRAWING: @RVP1_ADL_SB_ADP_S_DDR5_SODIMM_2DPC_LIB.H55_DG2_2DPC(SCH_1):PAGE522; CDS_LIB: local; VARIANT: ?; PCB Footprint: CTK0_SM_7300X6800_MA; SEC_TYPE: SM; CHIPS_PART_NAME: C_INDUCTOR; CDS_PART_NAME: C_INDUCTOR_SM-M24806-001,IND,4.7UH,20%,8A,TK0,GENERIC; CDS_LOCATION: L24073
Q24134 = C_MOSFET_N_ESD: CDS_PHYS_PART_NAME: C_MOSFET_N_ESD_SOT723-E19905-001,MFET,2SK3541T2L,TK0,GENERIC; CDS_LMAN_SYM_OUTLINE: -150,150,150,-150; FP_TECH: TK0; IP: GENERIC; PACK_TYPE: SOT723; ROOM: NONE; OriginalSymbolOrigin: (-150,150); XY: (2500,-1000); VER: 1; ROT: 0; PHYS_PAGE: 153; LOCATION: Q24134; DRAWING: @RVP1_ADL_SB_ADP_S_DDR5_SODIMM_2DPC_LIB.H55_DG2_2DPC(SCH_1):PAGE522; CDS_LIB: local; VARIANT: ?; PCB Footprint: CTK0_SOT723_900X1300_400_MA; SEC_TYPE: SOT723; CHIPS_PART_NAME: C_MOSFET_N_ESD; CDS_PART_NAME: C_MOSFET_N_ESD_SOT723-E19905-001,MFET,2SK3541T2L,TK0,GENERIC; CDS_LOCATION: Q24134
R15401 = C_RES_4TERM: CDS_PHYS_PART_NAME: C_RES_4TERM_2512_SM-H11517-001,RES,0.001,1%,2W,TK2,GENERIC; CDS_LMAN_SYM_OUTLINE: -50,50,50,-50; FP_TECH: TK2; IP: GENERIC; ROOM: NONE; OriginalSymbolOrigin: (-75,25); XY: (7025,2325); VER: 1; ROT: 0; PHYS_PAGE: 153; LOCATION: R15401; DRAWING: @RVP1_ADL_SB_ADP_S_DDR5_SODIMM_2DPC_LIB.H55_DG2_2DPC(SCH_1):PAGE522; CDS_LIB: c_discrete; VARIANT: ?; PCB Footprint: CTK2_SMR4_2512_6604X3434_MA; CHIPS_PART_NAME: C_RES_4TERM; CDS_PART_NAME: C_RES_4TERM_2512_SM-H11517-001,RES,0.001,1%,2W,TK2,GENERIC; CDS_LOCATION: R15401
R15402 = C_RES_4TERM: CDS_PHYS_PART_NAME: C_RES_4TERM_0612_SM-K52039-001,RES,0.005,1%,1W,TK0,GENERIC; CDS_LMAN_SYM_OUTLINE: -50,50,50,-50; FP_TECH: TK0; IP: GENERIC; ROOM: NONE; OriginalSymbolOrigin: (-75,25); XY: (1875,3225); VER: 1; SUB_ROOM_2: PMR; SUB_ROOM_1: V_CHRG_LDO; ROT: 0; PHYS_PAGE: 153; LOCATION: R15402; DRAWING: @RVP1_ADL_SB_ADP_S_DDR5_SODIMM_2DPC_LIB.H55_DG2_2DPC(SCH_1):PAGE522; CDS_LIB: c_discrete; VARIANT: ?; PCB Footprint: CTK0_SMR4_0612_1800X3450_MB_VR; SEC_TYPE: 0612_SM; CHIPS_PART_NAME: C_RES_4TERM; CDS_PART_NAME: C_RES_4TERM_0612_SM-K52039-001,RES,0.005,1%,1W,TK0,GENERIC; CDS_LOCATION: R15402
R15403 = C_RES_4TERM: CDS_PHYS_PART_NAME: C_RES_4TERM_0612_SM-K52039-001,RES,0.005,1%,1W,TK0,GENERIC; CDS_LMAN_SYM_OUTLINE: -50,50,50,-50; FP_TECH: TK0; IP: GENERIC; ROOM: NONE; OriginalSymbolOrigin: (-75,25); XY: (1875,3450); VER: 1; SUB_ROOM_2: PMR; SUB_ROOM_1: V_CHRG_LDO; ROT: 0; PHYS_PAGE: 153; LOCATION: R15403; DRAWING: @RVP1_ADL_SB_ADP_S_DDR5_SODIMM_2DPC_LIB.H55_DG2_2DPC(SCH_1):PAGE522; CDS_LIB: c_discrete; VARIANT: ?; PCB Footprint: CTK0_SMR4_0612_1800X3450_MB_VR; CHIPS_PART_NAME: C_RES_4TERM; CDS_PART_NAME: C_RES_4TERM_0612_SM-K52039-001,RES,0.005,1%,1W,TK0,GENERIC; CDS_LOCATION: R15403
R24003 = C_RES: CDS_PHYS_PART_NAME: C_RES_0402-G64084-130,RES,200K,1%,0.0625W,TK0,GENERIC; CDS_LMAN_SYM_OUTLINE: -50,50,50,-50; FP_TECH: TK0; IP: GENERIC; ROOM: NONE; OriginalSymbolOrigin: (-25,75); XY: (3375,1750); VER: 2; ROT: 0; PHYS_PAGE: 153; LOCATION: R24003; DRAWING: @RVP1_ADL_SB_ADP_S_DDR5_SODIMM_2DPC_LIB.H55_DG2_2DPC(SCH_1):PAGE522; CDS_LIB: c_discrete; VARIANT: ?; PCB Footprint: CTK0_SM0402_1100X550_MA; CHIPS_PART_NAME: C_RES; CDS_PART_NAME: C_RES_0402-G64084-130,RES,200K,1%,0.0625W,TK0,GENERIC; CDS_LOCATION: R24003
R24004 = C_RES: CDS_PHYS_PART_NAME: C_RES_0402-A93548-188,RES,40.2K,1%,0.0625W,TK2,GENERIC; CDS_LMAN_SYM_OUTLINE: -50,50,50,-50; FP_TECH: TK2; IP: GENERIC; ROOM: NONE; OriginalSymbolOrigin: (-25,75); XY: (3375,1450); VER: 2; ROT: 0; PHYS_PAGE: 153; LOCATION: R24004; DRAWING: @RVP1_ADL_SB_ADP_S_DDR5_SODIMM_2DPC_LIB.H55_DG2_2DPC(SCH_1):PAGE522; CDS_LIB: c_discrete; VARIANT: ?; PCB Footprint: CTK2_SM0402_1100X550_MA; CHIPS_PART_NAME: C_RES; CDS_PART_NAME: C_RES_0402-A93548-188,RES,40.2K,1%,0.0625W,TK2,GENERIC; CDS_LOCATION: R24004
R24005 = C_RES: CDS_PHYS_PART_NAME: C_RES_0402-A93549-027,RES,100K,5%,0.0625W,TK0,GENERIC; CDS_LMAN_SYM_OUTLINE: -50,50,50,-50; FP_TECH: TK0; IP: GENERIC; ROOM: NONE; OriginalSymbolOrigin: (-25,75); XY: (1550,1000); VER: 2; ROT: 0; PHYS_PAGE: 153; LOCATION: R24005; DRAWING: @RVP1_ADL_SB_ADP_S_DDR5_SODIMM_2DPC_LIB.H55_DG2_2DPC(SCH_1):PAGE522; CDS_LIB: c_discrete; VARIANT: ?; PCB Footprint: CTK0_SM0402_1100X550_MA; CHIPS_PART_NAME: C_RES; CDS_PART_NAME: C_RES_0402-A93549-027,RES,100K,5%,0.0625W,TK0,GENERIC; CDS_LOCATION: R24005
R24012 = C_RES#1: CHIPS_PART_NAME: C_RES; CDS_PHYS_PART_NAME: C_RES_0402-G60609-001,RES,0,1%,0.0625W,TK0,GENERIC; CDS_LMAN_SYM_OUTLINE: -50,50,50,-50; FP_TECH: TK0; IP: GENERIC; ROOM: NONE; OriginalSymbolOrigin: (-75,25); XY: (1725,-1050); VER: 1; PHYS_PAGE: 153; LOCATION: R24012; DRAWING: @RVP1_ADL_SB_ADP_S_DDR5_SODIMM_2DPC_LIB.H55_DG2_2DPC(SCH_1):PAGE522; CDS_LIB: c_discrete; VARIANT: ?; PCB Footprint: CTK0_SM0402_1050X550_MA; ROT: 0; CDS_PART_NAME: C_RES_0402-G60609-001,RES,0,1%,0.0625W,TK0,GENERIC; CDS_LOCATION: R24012
R24015 = C_RES: CDS_PHYS_PART_NAME: C_RES_0201-E11289-001,EMPTY,100K,5%,0.05W,TK0,GENERIC; CDS_LMAN_SYM_OUTLINE: -50,50,50,-50; FP_TECH: TK0; IP: GENERIC; ROOM: NONE; OriginalSymbolOrigin: (-25,75); XY: (1900,1025); VER: 2; ROT: 0; PHYS_PAGE: 153; LOCATION: R24015; DRAWING: @RVP1_ADL_SB_ADP_S_DDR5_SODIMM_2DPC_LIB.H55_DG2_2DPC(SCH_1):PAGE522; CDS_LIB: c_discrete; VARIANT: ?; PCB Footprint: CTK0_SM0201_650X350_MA; SEC_TYPE: 0201; CHIPS_PART_NAME: C_RES; CDS_PART_NAME: C_RES_0201-E11289-001,EMPTY,100K,5%,0.05W,TK0,GENERIC; CDS_LOCATION: R24015
R24018 = C_RES#1: CHIPS_PART_NAME: C_RES; CDS_PHYS_PART_NAME: C_RES_0402-A36092-023,EMPTY,1K,1%,0.0625W,TK0,GENERIC; CDS_LMAN_SYM_OUTLINE: -50,50,50,-50; FP_TECH: TK0; IP: GENERIC; ROOM: NONE; OriginalSymbolOrigin: (-75,25); XY: (3150,-750); VER: 1; ROT: 0; PHYS_PAGE: 153; LOCATION: R24018; DRAWING: @RVP1_ADL_SB_ADP_S_DDR5_SODIMM_2DPC_LIB.H55_DG2_2DPC(SCH_1):PAGE522; CDS_LIB: c_discrete; VARIANT: ?; PCB Footprint: CTK0_SM0402_1050X550_MA; SEC_TYPE: 0402; CDS_PART_NAME: C_RES_0402-A36092-023,EMPTY,1K,1%,0.0625W,TK0,GENERIC; CDS_LOCATION: R24018
R24021 = C_RES: CDS_PHYS_PART_NAME: C_RES_0201-C48657-004,EMPTY,10K,1%,0.05W,TK0,GENERIC; CDS_LMAN_SYM_OUTLINE: -50,50,50,-50; FP_TECH: TK0; IP: GENERIC; ROOM: NONE; OriginalSymbolOrigin: (-25,75); XY: (2575,1000); VER: 2; ROT: 0; PHYS_PAGE: 153; LOCATION: R24021; DRAWING: @RVP1_ADL_SB_ADP_S_DDR5_SODIMM_2DPC_LIB.H55_DG2_2DPC(SCH_1):PAGE522; CDS_LIB: c_discrete; VARIANT: ?; PCB Footprint: CTK0_SM0201_630X330_MA; CHIPS_PART_NAME: C_RES; CDS_PART_NAME: C_RES_0201-C48657-004,EMPTY,10K,1%,0.05W,TK0,GENERIC; CDS_LOCATION: R24021
R24025 = C_RES#1: CHIPS_PART_NAME: C_RES; CDS_PHYS_PART_NAME: C_RES_0603-A93550-001,RES,10,1%,0.1W,TK0,GENERIC; CDS_LMAN_SYM_OUTLINE: -50,50,50,-50; FP_TECH: TK0; IP: GENERIC; ROOM: NONE; OriginalSymbolOrigin: (-75,25); XY: (2700,2050); VER: 1; ROT: 0; PHYS_PAGE: 153; LOCATION: R24025; DRAWING: @RVP1_ADL_SB_ADP_S_DDR5_SODIMM_2DPC_LIB.H55_DG2_2DPC(SCH_1):PAGE522; CDS_LIB: c_discrete; VARIANT: ?; PCB Footprint: CTK0_SM0603_1800X950_MA; SEC_TYPE: 0603; CDS_PART_NAME: C_RES_0603-A93550-001,RES,10,1%,0.1W,TK0,GENERIC; CDS_LOCATION: R24025
R24030 = C_RES: CDS_PHYS_PART_NAME: C_RES_0201-C48657-004,EMPTY,10K,1%,0.05W,TK0,GENERIC; CDS_LMAN_SYM_OUTLINE: -50,50,50,-50; FP_TECH: TK0; IP: GENERIC; ROOM: NONE; OriginalSymbolOrigin: (-25,75); XY: (2925,1100); VER: 2; ROT: 0; PHYS_PAGE: 153; LOCATION: R24030; DRAWING: @RVP1_ADL_SB_ADP_S_DDR5_SODIMM_2DPC_LIB.H55_DG2_2DPC(SCH_1):PAGE522; CDS_LIB: c_discrete; VARIANT: ?; PCB Footprint: CTK0_SM0201_630X330_MA; CHIPS_PART_NAME: C_RES; CDS_PART_NAME: C_RES_0201-C48657-004,EMPTY,10K,1%,0.05W,TK0,GENERIC; CDS_LOCATION: R24030
R24031 = RES: CDS_PHYS_PART_NAME: RES_0402-A93548-246,CHIP,249K,1%,1/16W,LPDB,GENERIC; OriginalSymbolOrigin: (-25,75); XY: (3325,-450); VER: 2; ROT: 0; PHYS_PAGE: 153; LOCATION: R24031; IP: GENERIC; FP_TECH: LPDB; DRAWING: @RVP1_ADL_SB_ADP_S_DDR5_SODIMM_2DPC_LIB.H55_DG2_2DPC(SCH_1):PAGE522; CDS_LIB: discrete; PCB Footprint: SMR0402IA; CHIPS_PART_NAME: RES; CDS_PART_NAME: RES_0402-A93548-246,CHIP,249K,1%,1/16W,LPDB,GENERIC; CDS_LOCATION: R24031
R24034 = RES#1: PART_NUMBER: G21796-017; CHIPS_PART_NAME: RES; CDS_PHYS_PART_NAME: RES_0402-G21796-017,CHIP,100,1%,1/16W,LPDB,GENERIC; OriginalSymbolOrigin: (-75,25); XY: (2175,725); VER: 1; ROT: 0; PHYS_PAGE: 153; LOCATION: R24034; IP: GENERIC; FP_TECH: LPDB; DRAWING: @RVP1_ADL_SB_ADP_S_DDR5_SODIMM_2DPC_LIB.H55_DG2_2DPC(SCH_1):PAGE522; CDS_LIB: discrete; PCB Footprint: SMR0402IA; CDS_PART_NAME: RES_0402-G21796-017,CHIP,100,1%,1/16W,LPDB,GENERIC; CDS_LOCATION: R24034
R24036 = C_RES: CDS_PHYS_PART_NAME: C_RES_0402-A93548-557,RES,95.3K,1%,0.0625W,TK0,GENERIC; CDS_LMAN_SYM_OUTLINE: -50,50,50,-50; FP_TECH: TK0; IP: GENERIC; ROOM: NONE; OriginalSymbolOrigin: (-25,75); XY: (3275,1050); VER: 2; ROT: 0; PHYS_PAGE: 153; LOCATION: R24036; DRAWING: @RVP1_ADL_SB_ADP_S_DDR5_SODIMM_2DPC_LIB.H55_DG2_2DPC(SCH_1):PAGE522; CDS_LIB: c_discrete; VARIANT: ?; PCB Footprint: CTK0_SM0402_1100X550_MA; CHIPS_PART_NAME: C_RES; CDS_PART_NAME: C_RES_0402-A93548-557,RES,95.3K,1%,0.0625W,TK0,GENERIC; CDS_LOCATION: R24036
R24044 = C_RES: CDS_PHYS_PART_NAME: C_RES_0402-A93548-485,RES,38.3K,1%,0.0625,TK0,GENERIC; CDS_LMAN_SYM_OUTLINE: -50,50,50,-50; FP_TECH: TK0; IP: GENERIC; ROOM: NONE; OriginalSymbolOrigin: (-25,75); XY: (5150,-125); VER: 2; ROT: 0; PHYS_PAGE: 153; LOCATION: R24044; DRAWING: @RVP1_ADL_SB_ADP_S_DDR5_SODIMM_2DPC_LIB.H55_DG2_2DPC(SCH_1):PAGE522; CDS_LIB: c_discrete; VARIANT: ?; PCB Footprint: CTK0_SM0402_1100X550_MA; CHIPS_PART_NAME: C_RES; CDS_PART_NAME: C_RES_0402-A93548-485,RES,38.3K,1%,0.0625,TK0,GENERIC; CDS_LOCATION: R24044
R24045 = C_RES#1: CHIPS_PART_NAME: C_RES; CDS_PHYS_PART_NAME: C_RES_0402-A93548-272,RES,7.15K,1%,0.0625W,TK0,GENERIC; CDS_LMAN_SYM_OUTLINE: -50,50,50,-50; FP_TECH: TK0; IP: GENERIC; ROOM: NONE; OriginalSymbolOrigin: (-75,25); XY: (5500,1275); VER: 1; ROT: 0; PHYS_PAGE: 153; LOCATION: R24045; DRAWING: @RVP1_ADL_SB_ADP_S_DDR5_SODIMM_2DPC_LIB.H55_DG2_2DPC(SCH_1):PAGE522; CDS_LIB: c_discrete; VARIANT: ?; PCB Footprint: CTK0_SM0402_1100X550_MA; CDS_PART_NAME: C_RES_0402-A93548-272,RES,7.15K,1%,0.0625W,TK0,GENERIC; CDS_LOCATION: R24045
R24046 = C_RES#1: CHIPS_PART_NAME: C_RES; CDS_PHYS_PART_NAME: C_RES_0402-A93548-043,RES,100,1%,0.0625W,TK0,GENERIC; CDS_LMAN_SYM_OUTLINE: -50,50,50,-50; FP_TECH: TK0; IP: GENERIC; ROOM: NONE; OriginalSymbolOrigin: (-75,25); XY: (5800,1975); VER: 1; ROT: 0; PHYS_PAGE: 153; LOCATION: R24046; DRAWING: @RVP1_ADL_SB_ADP_S_DDR5_SODIMM_2DPC_LIB.H55_DG2_2DPC(SCH_1):PAGE522; CDS_LIB: c_discrete; VARIANT: ?; PCB Footprint: CTK0_SM0402_1100X550_MA; CDS_PART_NAME: C_RES_0402-A93548-043,RES,100,1%,0.0625W,TK0,GENERIC; CDS_LOCATION: R24046
R24048 = C_RES: CDS_PHYS_PART_NAME: C_RES_0402-G60609-001,RES,0,1%,0.0625W,TK0,GENERIC; CDS_LMAN_SYM_OUTLINE: -50,50,50,-50; FP_TECH: TK0; IP: GENERIC; ROOM: NONE; OriginalSymbolOrigin: (-25,75); XY: (5750,1500); VER: 2; ROT: 1; PHYS_PAGE: 153; LOCATION: R24048; DRAWING: @RVP1_ADL_SB_ADP_S_DDR5_SODIMM_2DPC_LIB.H55_DG2_2DPC(SCH_1):PAGE522; CDS_LIB: c_discrete; VARIANT: ?; PCB Footprint: CTK0_SM0402_1050X550_MA; CHIPS_PART_NAME: C_RES; CDS_PART_NAME: C_RES_0402-G60609-001,RES,0,1%,0.0625W,TK0,GENERIC; CDS_LOCATION: R24048
R24049 = RES: CDS_PHYS_PART_NAME: RES_0402-G21796-109,CHIP,150K,1%,1/16W,LPDB,GENERIC; OriginalSymbolOrigin: (-25,75); XY: (5875,-125); VER: 2; ROT: 0; PHYS_PAGE: 153; LOCATION: R24049; IP: GENERIC; FP_TECH: LPDB; DRAWING: @RVP1_ADL_SB_ADP_S_DDR5_SODIMM_2DPC_LIB.H55_DG2_2DPC(SCH_1):PAGE522; CDS_LIB: discrete; PCB Footprint: SMR0402IA; CHIPS_PART_NAME: RES; CDS_PART_NAME: RES_0402-G21796-109,CHIP,150K,1%,1/16W,LPDB,GENERIC; CDS_LOCATION: R24049
R24053 = C_RES#1: CHIPS_PART_NAME: C_RES; CDS_PHYS_PART_NAME: C_RES_0402-G60609-001,RES,0,1%,0.0625W,TK0,GENERIC; CDS_LMAN_SYM_OUTLINE: -50,50,50,-50; FP_TECH: TK0; IP: GENERIC; ROOM: NONE; OriginalSymbolOrigin: (-75,25); XY: (6025,1125); VER: 1; PHYS_PAGE: 153; LOCATION: R24053; DRAWING: @RVP1_ADL_SB_ADP_S_DDR5_SODIMM_2DPC_LIB.H55_DG2_2DPC(SCH_1):PAGE522; CDS_LIB: c_discrete; VARIANT: ?; PCB Footprint: CTK0_SM0402_1050X550_MA; ROT: 0; CDS_PART_NAME: C_RES_0402-G60609-001,RES,0,1%,0.0625W,TK0,GENERIC; CDS_LOCATION: R24053
R24055 = RES#1: CHIPS_PART_NAME: RES; CDS_PHYS_PART_NAME: RES_0402-A93549-059,CHIP,4.7,5%,1/16W,LPDB,GENERIC; OriginalSymbolOrigin: (-75,25); XY: (6850,375); VER: 1; ROT: 0; PHYS_PAGE: 153; LOCATION: R24055; IP: GENERIC; FP_TECH: LPDB; DRAWING: @RVP1_ADL_SB_ADP_S_DDR5_SODIMM_2DPC_LIB.H55_DG2_2DPC(SCH_1):PAGE522; CDS_LIB: discrete; PCB Footprint: SMR0402IA; CDS_PART_NAME: RES_0402-A93549-059,CHIP,4.7,5%,1/16W,LPDB,GENERIC; CDS_LOCATION: R24055
R24068 = C_RES: CDS_PHYS_PART_NAME: C_RES_0603-A93550-473,RES,2.2,1%,0.1W,TK0,GENERIC; CDS_LMAN_SYM_OUTLINE: -50,50,50,-50; FP_TECH: TK0; IP: GENERIC; ROOM: NONE; OriginalSymbolOrigin: (-25,75); XY: (8200,825); VER: 2; SUB_ROOM_2: MISC; SUB_ROOM_1: V_CHRG_LDO; PHYS_PAGE: 153; LOCATION: R24068; DRAWING: @RVP1_ADL_SB_ADP_S_DDR5_SODIMM_2DPC_LIB.H55_DG2_2DPC(SCH_1):PAGE522; CDS_LIB: c_discrete; VARIANT: ?; PCB Footprint: CTK0_SM0603_1800X900_MA; SUB_ROOM: MISC; ROT: 2; CHIPS_PART_NAME: C_RES; CDS_PART_NAME: C_RES_0603-A93550-473,RES,2.2,1%,0.1W,TK0,GENERIC; CDS_LOCATION: R24068
R24070 = C_RES: CDS_PHYS_PART_NAME: C_RES_0201-C48657-049,RES,499,1%,0.05W,TK0,GENERIC; CDS_LMAN_SYM_OUTLINE: -50,50,50,-50; FP_TECH: TK0; IP: GENERIC; ROOM: NONE; OriginalSymbolOrigin: (-25,75); XY: (7950,475); VER: 2; ROT: 0; PHYS_PAGE: 153; LOCATION: R24070; DRAWING: @RVP1_ADL_SB_ADP_S_DDR5_SODIMM_2DPC_LIB.H55_DG2_2DPC(SCH_1):PAGE522; CDS_LIB: c_discrete; VARIANT: ?; PCB Footprint: CTK0_SM0201_630X330_MA; SEC_TYPE: 0201; CHIPS_PART_NAME: C_RES; CDS_PART_NAME: C_RES_0201-C48657-049,RES,499,1%,0.05W,TK0,GENERIC; CDS_LOCATION: R24070
R24075 = RES_2#1: CHIPS_PART_NAME: RES_2; CDS_PHYS_PART_NAME: RES_2_0402-C17927-001,RES,0,1%,1/16W,TK2,GENERIC; CDS_LMAN_SYM_OUTLINE: -50,50,50,-50; FP_TECH: TK2; IP: GENERIC; ROOM: NONE; OriginalSymbolOrigin: (-75,25); XY: (8425,1325); VER: 1; PHYS_PAGE: 153; LOCATION: R24075; DRAWING: @RVP1_ADL_SB_ADP_S_DDR5_SODIMM_2DPC_LIB.H55_DG2_2DPC(SCH_1):PAGE522; CDS_LIB: discrete_2; VARIANT: ?; PCB Footprint: TK2_SM0402_1100X550_MA; ROT: 0; CDS_PART_NAME: RES_2_0402-C17927-001,RES,0,1%,1/16W,TK2,GENERIC; CDS_LOCATION: R24075
R24076 = C_RES: CDS_PHYS_PART_NAME: C_RES_0201-C48657-057,RES,100K,1%,0.05W,TK0,GENERIC; CDS_LMAN_SYM_OUTLINE: -50,50,50,-50; FP_TECH: TK0; IP: GENERIC; ROOM: NONE; OriginalSymbolOrigin: (-25,75); XY: (1700,250); VER: 2; ROT: 0; PHYS_PAGE: 153; LOCATION: R24076; DRAWING: @RVP1_ADL_SB_ADP_S_DDR5_SODIMM_2DPC_LIB.H55_DG2_2DPC(SCH_1):PAGE522; CDS_LIB: c_discrete; VARIANT: ?; PCB Footprint: CTK0_SM0201_630X330_MA; CHIPS_PART_NAME: C_RES; CDS_PART_NAME: C_RES_0201-C48657-057,RES,100K,1%,0.05W,TK0,GENERIC; CDS_LOCATION: R24076
R24078 = C_RES#1: CHIPS_PART_NAME: C_RES; CDS_PHYS_PART_NAME: C_RES_0201-C48657-004,RES,10K,1%,0.05W,TK0,GENERIC; CDS_LMAN_SYM_OUTLINE: -50,50,50,-50; FP_TECH: TK0; IP: GENERIC; ROOM: NONE; OriginalSymbolOrigin: (-75,25); XY: (1900,0); VER: 1; ROT: 0; PHYS_PAGE: 153; LOCATION: R24078; DRAWING: @RVP1_ADL_SB_ADP_S_DDR5_SODIMM_2DPC_LIB.H55_DG2_2DPC(SCH_1):PAGE522; CDS_LIB: c_discrete; VARIANT: ?; PCB Footprint: CTK0_SM0201_630X330_MA; CDS_PART_NAME: C_RES_0201-C48657-004,RES,10K,1%,0.05W,TK0,GENERIC; CDS_LOCATION: R24078
R24097 = RES: CDS_PHYS_PART_NAME: RES_0402-G21796-090,CHIP,1,1%,1/16W,LPDB,GENERIC; OriginalSymbolOrigin: (-25,75); XY: (1625,2975); VER: 2; ROT: 0; PHYS_PAGE: 153; LOCATION: R24097; IP: GENERIC; FP_TECH: LPDB; DRAWING: @RVP1_ADL_SB_ADP_S_DDR5_SODIMM_2DPC_LIB.H55_DG2_2DPC(SCH_1):PAGE522; CDS_LIB: discrete; PCB Footprint: SMR0402IA; CHIPS_PART_NAME: RES; CDS_PART_NAME: RES_0402-G21796-090,CHIP,1,1%,1/16W,LPDB,GENERIC; CDS_LOCATION: R24097
R24100 = RES: CDS_PHYS_PART_NAME: RES_0402-A36092-285,CHIP,2,1%,1/16W,LPDB,GENERIC; OriginalSymbolOrigin: (-25,75); XY: (2150,3000); ROT: 0; PHYS_PAGE: 153; LOCATION: R24100; IP: GENERIC; FP_TECH: LPDB; DRAWING: @RVP1_ADL_SB_ADP_S_DDR5_SODIMM_2DPC_LIB.H55_DG2_2DPC(SCH_1):PAGE522; CDS_LIB: discrete; PCB Footprint: SMR0402IA; VER: 2; CHIPS_PART_NAME: RES; CDS_PART_NAME: RES_0402-A36092-285,CHIP,2,1%,1/16W,LPDB,GENERIC; CDS_LOCATION: R24100
R28055 = RES_2: CDS_PHYS_PART_NAME: RES_2_0603-A93553-150,RES,158K,0.1%,0.0625W,TK0,GENERIC; CDS_LMAN_SYM_OUTLINE: -50,50,50,-50; FP_TECH: TK0; IP: GENERIC; ROOM: NONE; OriginalSymbolOrigin: (-25,75); XY: (1250,425); VER: 2; ROT: 0; PHYS_PAGE: 153; LOCATION: R28055; DRAWING: @RVP1_ADL_SB_ADP_S_DDR5_SODIMM_2DPC_LIB.H55_DG2_2DPC(SCH_1):PAGE522; CDS_LIB: discrete_2; VARIANT: ?; PCB Footprint: TK0_SM0603_1800X900_MF; CHIPS_PART_NAME: RES_2; CDS_PART_NAME: RES_2_0603-A93553-150,RES,158K,0.1%,0.0625W,TK0,GENERIC; CDS_LOCATION: R28055
R28067 = C_RES: CDS_PHYS_PART_NAME: C_RES_0402-A93549-027,EMPTY,100K,5%,0.0625W,TK0,GENERIC; CDS_LMAN_SYM_OUTLINE: -50,50,50,-50; FP_TECH: TK0; IP: GENERIC; ROOM: NONE; OriginalSymbolOrigin: (-25,75); XY: (1250,1025); VER: 2; ROT: 0; PHYS_PAGE: 153; LOCATION: R28067; DRAWING: @RVP1_ADL_SB_ADP_S_DDR5_SODIMM_2DPC_LIB.H55_DG2_2DPC(SCH_1):PAGE522; CDS_LIB: c_discrete; VARIANT: ?; PCB Footprint: CTK0_SM0402_1100X550_MA; CHIPS_PART_NAME: C_RES; CDS_PART_NAME: C_RES_0402-A93549-027,EMPTY,100K,5%,0.0625W,TK0,GENERIC; CDS_LOCATION: R28067
RT24001 = C_THERMISTOR: CDS_PHYS_PART_NAME: C_THERMISTOR_0603-C14407-009,THERM,220K,5%,0.1W,TK0,GENERIC; CDS_LMAN_SYM_OUTLINE: -50,50,50,-50; FP_TECH: TK0; IP: GENERIC; ROOM: NONE; OriginalSymbolOrigin: (-75,50); XY: (6100,1275); VER: 1; ROT: 0; PHYS_PAGE: 153; LOCATION: RT24001; DRAWING: @RVP1_ADL_SB_ADP_S_DDR5_SODIMM_2DPC_LIB.H55_DG2_2DPC(SCH_1):PAGE522; CDS_LIB: c_discrete; VARIANT: ?; PCB Footprint: CTK0_SM0603_1800X1000_MA; SEC_TYPE: 0603; CHIPS_PART_NAME: C_THERMISTOR; CDS_PART_NAME: C_THERMISTOR_0603-C14407-009,THERM,220K,5%,0.1W,TK0,GENERIC; CDS_LOCATION: RT24001
TP24042 = TP#3: PART_NUMBER: NA_TPC25; CDS_PHYS_PART_NAME: TP_SM-NA_TPC25,EMPTY,TP_C25,LPDB,GENERIC; CDS_LMAN_SYM_OUTLINE: -100,50,100,-50; PACK_TYPE: SM; OriginalSymbolOrigin: (0,25); XY: (3750,525); VER: 6; ROT: 0; ROOM: ROOM_PROP_TEST_70; PHYS_PAGE: 153; LOCATION: TP24042; DRAWING: @RVP1_ADL_SB_ADP_S_DDR5_SODIMM_2DPC_LIB.H55_DG2_2DPC(SCH_1):PAGE522; CDS_LIB: board_artifacts; MATERIAL: EMPTY; PCB Footprint: TP_C25; CHIPS_PART_NAME: TP; CDS_PART_NAME: TP_SM-NA_TPC25,EMPTY,TP_C25,LPDB,GENERIC; CDS_LOCATION: TP24042
U24043 = MOSFET_N_DUAL_ASYM_2: CDS_PHYS_PART_NAME: MOSFET_N_DUAL_ASYM_2_LCC-K55226-001,MFET,AONY36352,TK0,GENERIC; CDS_LMAN_SYM_OUTLINE: -250,300,250,-300; FP_TECH: TK0; IP: GENERIC; PACK_TYPE: LCC; ROOM: NONE; OriginalSymbolOrigin: (-275,300); XY: (7575,1375); VER: 1; ROT: 0; PHYS_PAGE: 153; LOCATION: U24043; DRAWING: @RVP1_ADL_SB_ADP_S_DDR5_SODIMM_2DPC_LIB.H55_DG2_2DPC(SCH_1):PAGE522; CDS_LIB: local; BOM_USE: STUFF; VARIANT: ?; PCB Footprint: TK0_LCC8_5650X5300_1270_DF2550X4650_MA_VR; SEC_TYPE: LCC; CHIPS_PART_NAME: MOSFET_N_DUAL_ASYM_2; CDS_PART_NAME: MOSFET_N_DUAL_ASYM_2_LCC-K55226-001,MFET,AONY36352,TK0,GENERIC; CDS_LOCATION: U24043